# Altium project 100-1069.PRJPCB (part 1 of 2)
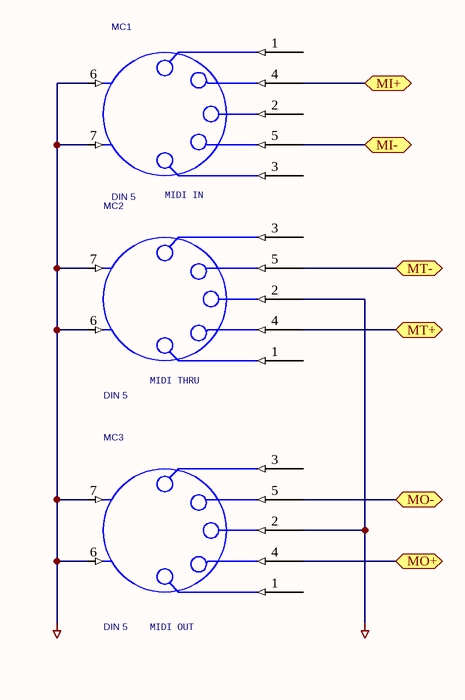
[diagram p0: PAGE1.SchDoc]
24 sheets, 470 parts. Net scope: hierarchical (ports join the sheet entries above them; power ports are global).
Sheets:
  PAGE1.SchDoc
  PAGE11.SchDoc
  PAGE12.SchDoc
  PAGE14.SchDoc
  PAGE15.SchDoc
  PAGE16.SchDoc
  PAGE18.SchDoc
  PAGE19.SchDoc
  PAGE111.SchDoc
  PAGE112.SchDoc
  PAGE113.SchDoc
    POTSCALE1 = PAGE17.SchDoc
    EG1 = PAGE13.SchDoc
    MIDI = PAGE115.SchDoc
    VCO1 = PAGE117.SchDoc
    REF = PAGE110.SchDoc
    VCO2 = PAGE117.SchDoc
    POTSCALE2 = PAGE17.SchDoc
  LFO.SchDoc
  PAGE114.SchDoc
  GLIDE.SchDoc
  PAGE116.SchDoc
  PAGE118.SchDoc
  PAGE119.SchDoc
  PAGE120.SchDoc
  PAGE121.SchDoc

## Sheet PAGE1.SchDoc
size 246 x 182 mm

### Parts
MC1  DIN 5  [DIN 5 PIN A]
MC2  DIN 5  [DIN 5 PIN A]
MC3  DIN 5  [DIN 5 PIN A]

### Ports
MI+, MI-, MO+, MO-, MT+, MT-

### Nets
AGND: MC1.6 MC1.7 MC2.2 MC2.6 MC2.7 MC3.2 MC3.6 MC3.7  [project net S2]
NetMC1_4: MC1.4 ; port MI+
NetMC1_5: MC1.5 ; port MI-
NetMC2_4: MC2.4 ; port MT+
NetMC2_5: MC2.5 ; port MT-
NetMC3_4: MC3.4 ; port MO+
NetMC3_5: MC3.5 ; port MO-

Not connected (* = marked no-connect by the designer): MC1 1 2 3; MC2 1 3; MC3 1 3

### Notes on the sheet
- (near MC1) MIDI IN
- (near MC2) MIDI THRU
- (near MC3) MIDI OUT

### Library data of the parts
MC1-MC3 = DIN 5_0: PART NO: 161-0505

## Sheet PAGE11.SchDoc
size 246 x 182 mm
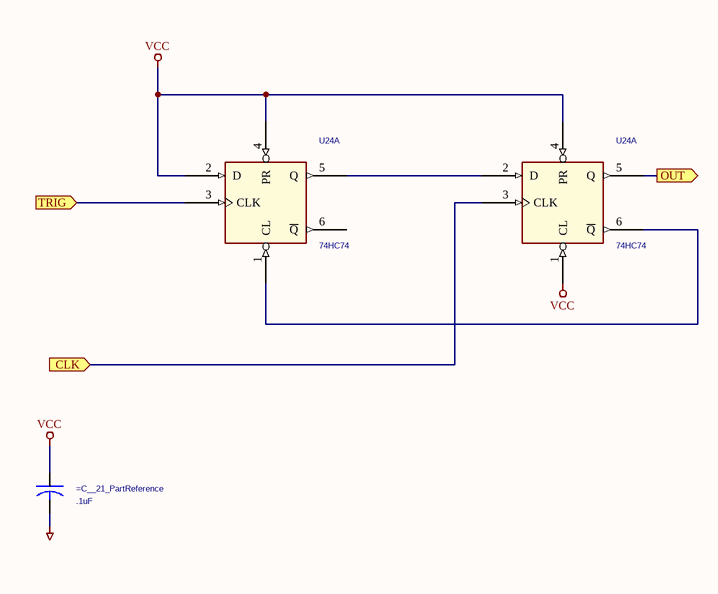
[diagram p1: PAGE11.SchDoc]

### Parts
(Parts that share a designator on the sheet are numbered #1, #2 ... from top to bottom, then left to right.)
=C__21_PartReference  .1uF  [AXIALCAP0.3]
U24#1  74HC74  [DIP14]  (part A of 2)
U24#2  74HC74  [DIP14]  (part A of 2)

### Ports
CLK (in), OUT (out), TRIG (in)

### Nets
AGND: =C__21_PartReference.2 U24#1.7(GND) U24#2.7(GND)  [also labelled GND]  [project net S2]
VCC: =C__21_PartReference.1 U24#1.2(D) U24#1.4(PR) U24#1.14(VCC) U24#2.1(CL) U24#2.4(PR) U24#2.14(VCC)
NetU24#1_1: U24#1.1(CL) U24#2.6(~{Q})
NetU24#1_3: U24#1.3(CLK) ; port TRIG
NetU24#1_5: U24#1.5(Q) U24#2.2(D)
NetU24#2_3: U24#2.3(CLK) ; port CLK
NetU24#2_5: U24#2.5(Q) ; port OUT

Not connected (* = marked no-connect by the designer): U24#1 6(~{Q})

### Library data of the parts
=C__21_PartReference = CAP_Dup1: PART NO: 80-C410C104M5U

## Sheet PAGE12.SchDoc
size 246 x 182 mm
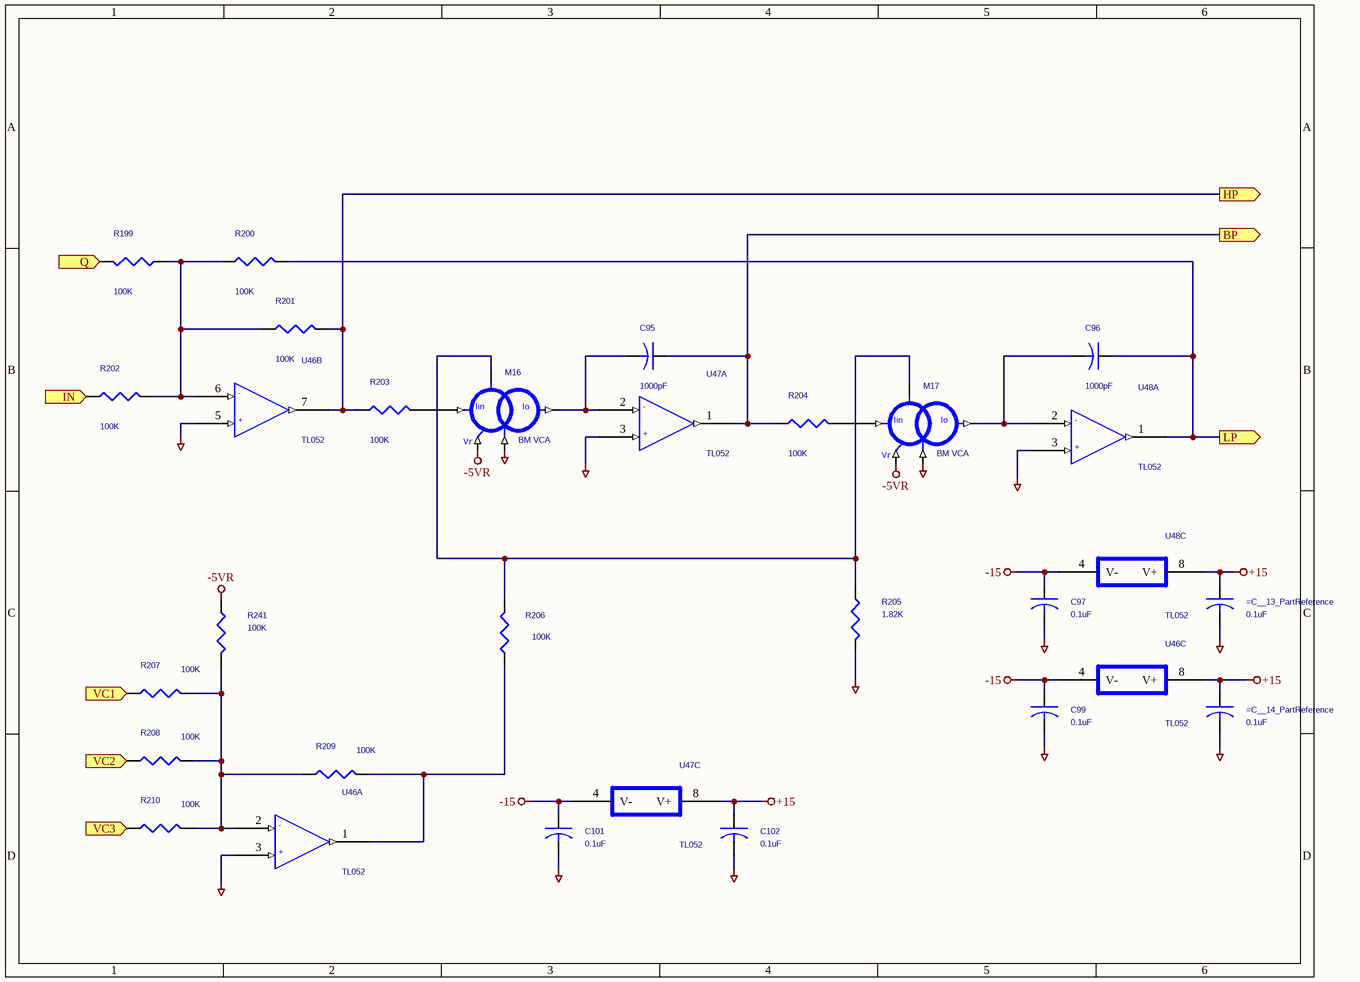
[diagram p2: PAGE12.SchDoc]

### Parts
=C__13_PartReference  0.1uF  [AXIALCAP0.3]
=C__14_PartReference  0.1uF  [AXIALCAP0.3]
C95  1000pF  [AXIAL0.5X0.2]
C96  1000pF  [AXIAL0.5X0.2]
C97  0.1uF  [AXIALCAP0.3]
C99  0.1uF  [AXIALCAP0.3]
C101  0.1uF  [AXIALCAP0.3]
C102  0.1uF  [AXIALCAP0.3]
M16  BM VCA
M17  BM VCA
R199  100K  [AXIAL0.4]
R200  100K  [AXIAL0.4]
R201  100K  [AXIAL0.4]
R202  100K  [AXIAL0.4]
R203  100K  [AXIAL0.4]
R204  100K  [AXIAL0.4]
R205  1.82K  [AXIAL0.4]
R206  100K  [AXIAL0.4]
R207  100K  [AXIAL0.4]
R208  100K  [AXIAL0.4]
R209  100K  [AXIAL0.4]
R210  100K  [AXIAL0.4]
R241  100K  [AXIAL0.4]
U46  TL052  [DIP8]  (parts A,B,C of 3)
U47  TL052  [DIP8]  (parts A,C of 3)
U48  TL052  [DIP8]  (parts A,C of 3)

### Ports
BP (out), HP (out), IN (in), LP (out), Q (in), VC1 (in), VC2 (in), VC3 (in)

### Nets
+15: =C__13_PartReference.1 =C__14_PartReference.1 C102.1 U46.8(V+) U47.8(V+) U48.8(V+)
-5VR: M16.-VR M17.-VR R241.1
-15: C97.1 C99.1 C101.1 U46.4(V-) U47.4(V-) U48.4(V-)
AGND: =C__13_PartReference.2 =C__14_PartReference.2 C97.2 C99.2 C101.2 C102.2 M16.CVP M17.CVP R205.2 U46.3(+) U46.5(+) U47.3(+) U48.3(+)  [project net S2]
NetC95_1: C95.1 R204.1 U47.1(OUT) ; port BP
NetC95_2: C95.2 M16.Io U47.2(-)
NetC96_1: C96.1 R200.2 U48.1(OUT) ; port LP
NetC96_2: C96.2 M17.Io U48.2(-)
NetM16_CVN: M16.CVN M17.CVN R205.1 R206.2
NetM16_Iin: M16.Iin R203.2
NetM17_Iin: M17.Iin R204.2
NetR199_1: R199.1 R200.1 R201.1 R202.2 U46.6(-)
NetR199_2: R199.2 ; port Q
NetR201_2: R201.2 R203.1 U46.7(OUT) ; port HP
NetR202_1: R202.1 ; port IN
NetR206_1: R206.1 R209.2 U46.1(OUT)
NetR207_1: R207.1 ; port VC1
NetR207_2: R207.2 R208.2 R209.1 R210.2 R241.2 U46.2(-)
NetR208_1: R208.1 ; port VC2
NetR210_1: R210.1 ; port VC3

### Notes on the sheet
- (in symbol BM VCA) Vr

### Library data of the parts
=C__13_PartReference =C__14_PartReference C95-C97 C99 C101 C102 = CAP_Dup1
R199-R210 R241 = R_Dup1
U46-U48 = GEN DUAL OPAMP-H
  U46: PACKAGE: VCF
  U47: PACKAGE: VCF1
  U48: PACKAGE: VCF2
M16 M17 = BM VCA
  M16: U__9_PartReference: =M16_U__9_PartReference; U__9_PACKAGE: =M16_U__9_PACKAGE; Q__7_PartReference: =M16_Q__7_PartReference; Q__4_PartReference: =M16_Q__4_PartReference; Q__5_PartReference: =M16_Q__5_PartReference; Q__6_PartReference: =M16_Q__6_PartReference; R__32_PartReference: =M16_R__32_PartReference; R__33_PartReference: =M16_R__33_PartReference; C__10_PartReference: =M16_C__10_PartReference; TitleBlock_2_Page_Number: =M16_TitleBlock_2_Page_Number; TitleBlock_2_Title: =M16_TitleBlock_2_Title
  M17: U__9_PartReference: =M17_U__9_PartReference; U__9_PACKAGE: =M17_U__9_PACKAGE; Q__7_PartReference: =M17_Q__7_PartReference; Q__4_PartReference: =M17_Q__4_PartReference; Q__5_PartReference: =M17_Q__5_PartReference; Q__6_PartReference: =M17_Q__6_PartReference; R__32_PartReference: =M17_R__32_PartReference; R__33_PartReference: =M17_R__33_PartReference; C__10_PartReference: =M17_C__10_PartReference; TitleBlock_2_Page_Number: =M17_TitleBlock_2_Page_Number; TitleBlock_2_Title: =M17_TitleBlock_2_Title

## Sheet PAGE14.SchDoc
size 246 x 182 mm
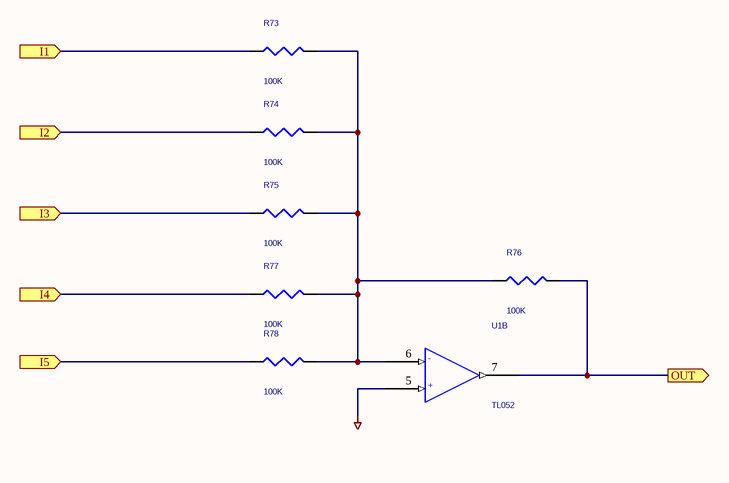
[diagram p3: PAGE14.SchDoc]

### Parts
R73  100K  [AXIAL0.4]
R74  100K  [AXIAL0.4]
R75  100K  [AXIAL0.4]
R76  100K  [AXIAL0.4]
R77  100K  [AXIAL0.4]
R78  100K  [AXIAL0.4]
U1  TL052  [DIP8]  (part B of 3)

### Ports
I1 (in), I2 (in), I3 (in), I4 (in), I5 (in), OUT (out)

### Nets
AGND: U1.5(+)  [project net S2]
NetR73_1: R73.1 ; port I1
NetR73_2: R73.2 R74.2 R75.2 R76.1 R77.2 R78.2 U1.6(-)
NetR74_1: R74.1 ; port I2
NetR75_1: R75.1 ; port I3
NetR76_2: R76.2 U1.7(OUT) ; port OUT
NetR77_1: R77.1 ; port I4
NetR78_1: R78.1 ; port I5

### Library data of the parts
R73-R78 = R_Dup1: MOUSER PN: 271-100K-RC
U1 = GEN DUAL OPAMP-H: PACKAGE: ATNM1MIX

## Sheet PAGE15.SchDoc
size 386 x 284 mm
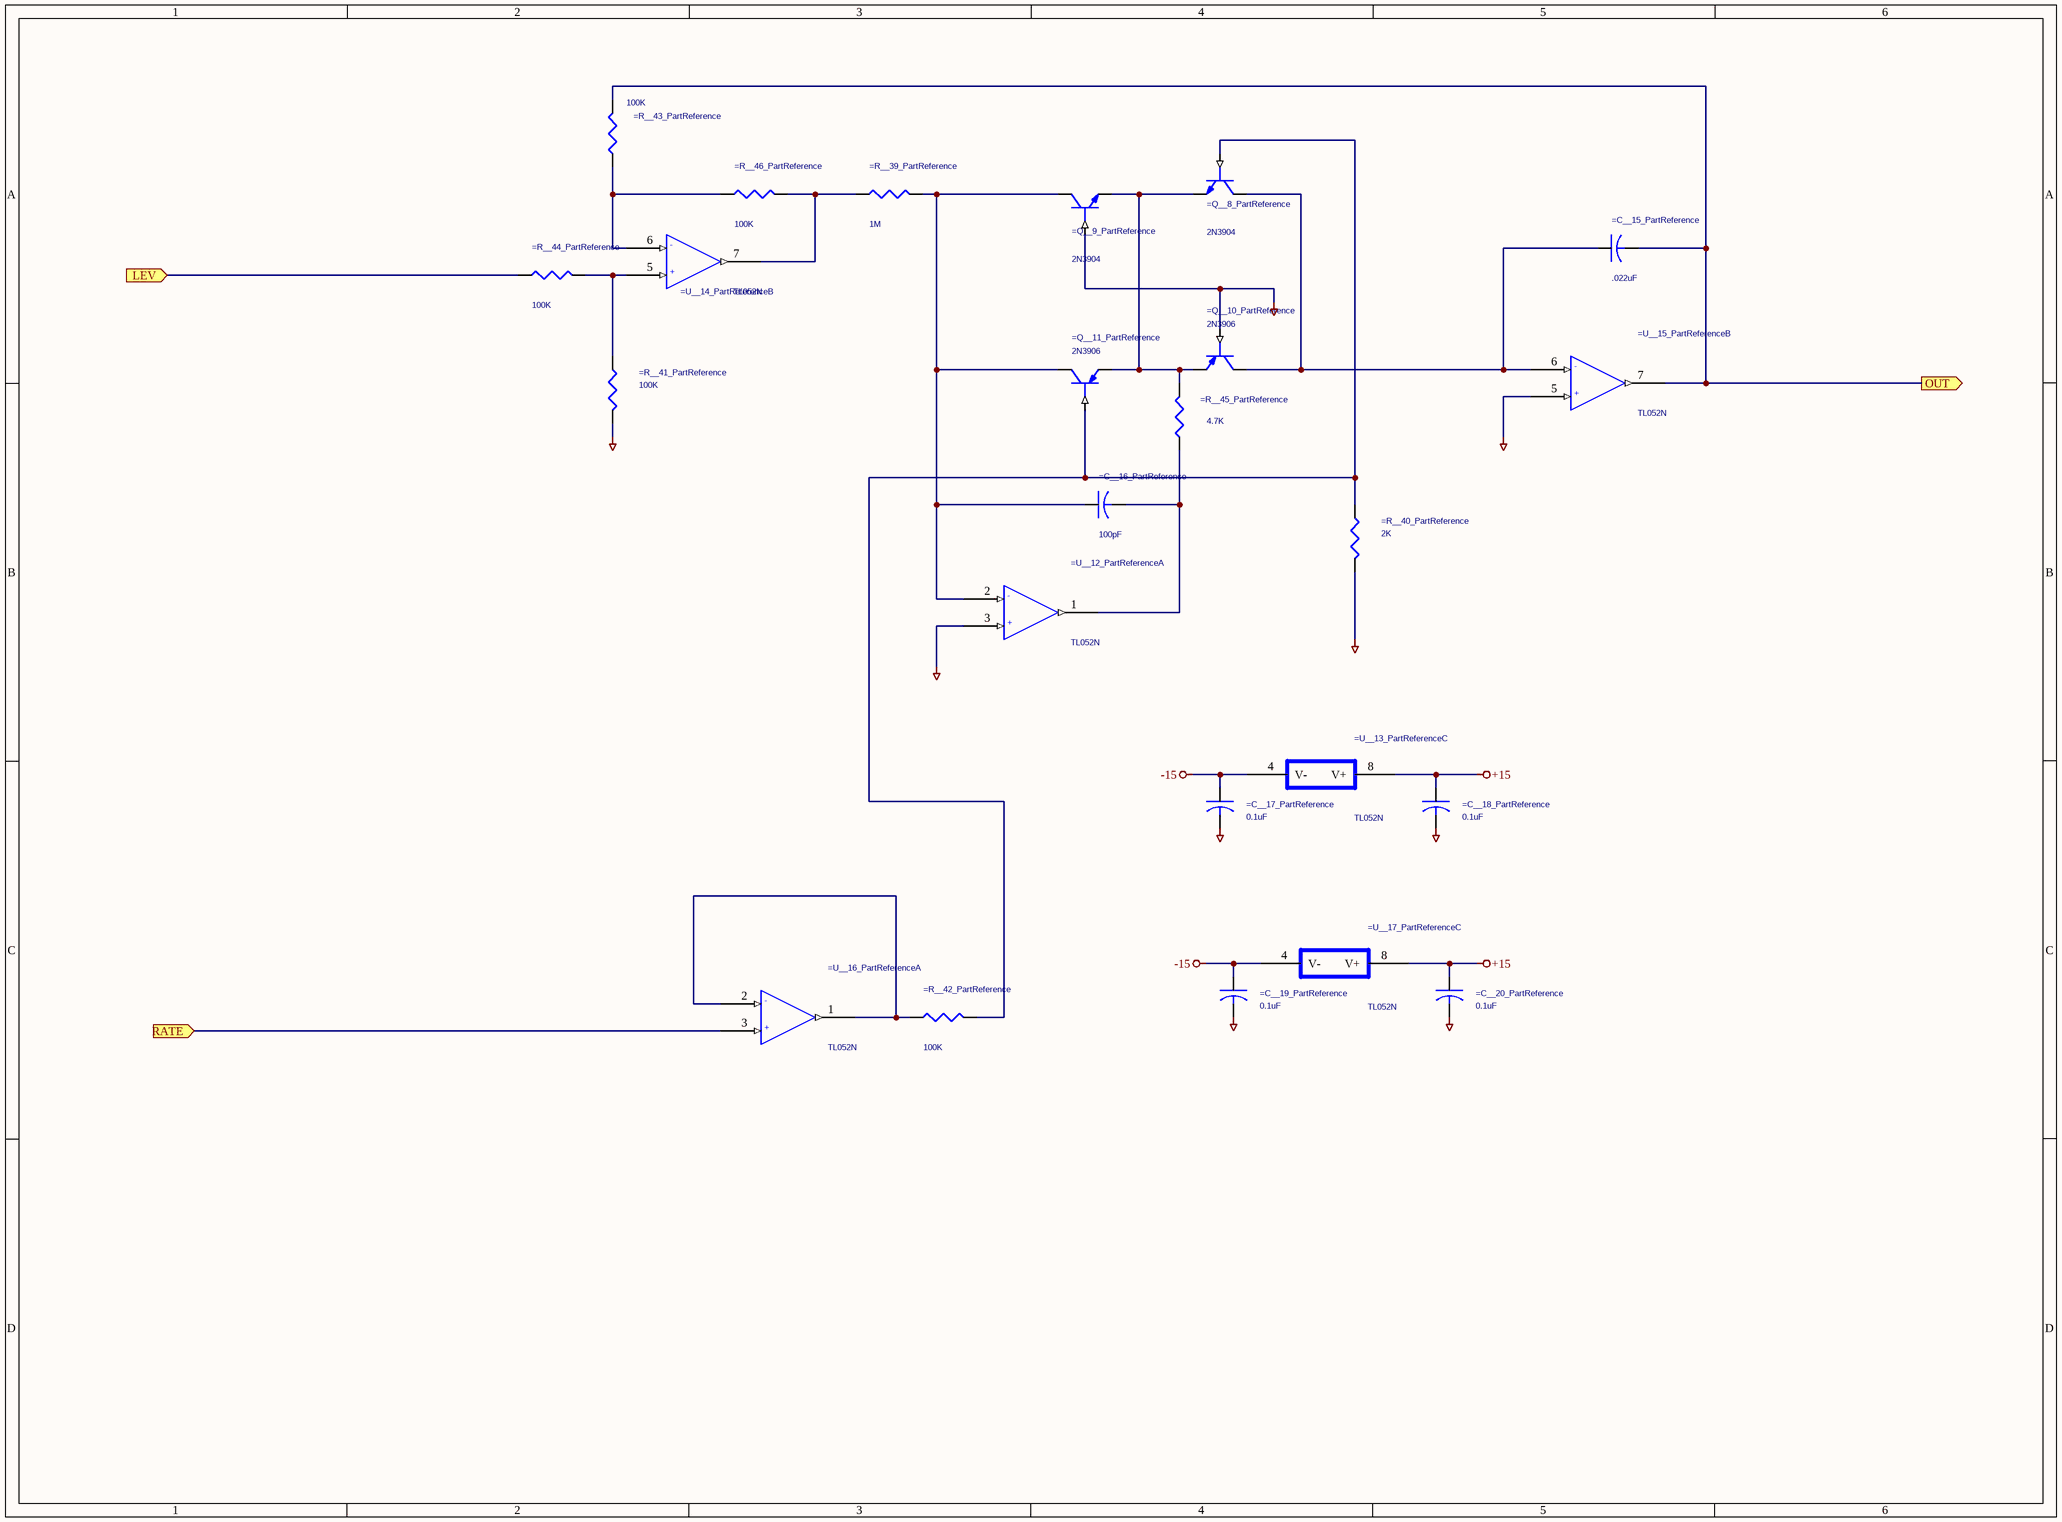
[diagram p4: PAGE15.SchDoc]

### Parts
=C__15_PartReference  .022uF  [CAP-MY0.2X.1]
=C__16_PartReference  100pF  [RAD0.1]
=C__17_PartReference  0.1uF  [AXIALCAP0.3]
=C__18_PartReference  0.1uF  [AXIALCAP0.3]
=C__19_PartReference  0.1uF  [AXIALCAP0.3]
=C__20_PartReference  0.1uF  [AXIALCAP0.3]
=Q__8_PartReference  2N3904  [TO92]
=Q__9_PartReference  2N3904  [TO92]
=Q__10_PartReference  2N3906  [TO92]
=Q__11_PartReference  2N3906  [TO92]
=R__39_PartReference  1M  [AXIAL0.4]
=R__40_PartReference  2K  [AXIAL0.4]
=R__41_PartReference  100K  [AXIAL0.4]
=R__42_PartReference  100K  [AXIAL0.4]
=R__43_PartReference  100K  [AXIAL0.4]
=R__44_PartReference  100K  [AXIAL0.4]
=R__45_PartReference  4.7K  [AXIAL0.4]
=R__46_PartReference  100K  [AXIAL0.4]
=U__12_PartReference  TL052N  [DIP8]  (part A of 3)
=U__13_PartReference  TL052N  [DIP8]  (part C of 3)
=U__14_PartReference  TL052N  [DIP8]  (part B of 3)
=U__15_PartReference  TL052N  [DIP8]  (part B of 3)
=U__16_PartReference  TL052N  [DIP8]  (part A of 3)
=U__17_PartReference  TL052N  [DIP8]  (part C of 3)

### Ports
LEV (in), OUT (out), RATE (in)

### Nets
+15: =C__18_PartReference.1 =C__20_PartReference.1 =U__13_PartReference.8(V+) =U__17_PartReference.8(V+)
-15: =C__17_PartReference.1 =C__19_PartReference.1 =U__13_PartReference.4(V-) =U__17_PartReference.4(V-)
AGND: =C__17_PartReference.2 =C__18_PartReference.2 =C__19_PartReference.2 =C__20_PartReference.2 =Q__9_PartReference.BASE =Q__10_PartReference.BASE =R__40_PartReference.2 =R__41_PartReference.2 =U__12_PartReference.3(+) =U__15_PartReference.5(+)  [project net S2]
Net=C__15_PartReference_1: =C__15_PartReference.1 =Q__8_PartReference.COLLECTOR =Q__10_PartReference.COLLECTOR =U__15_PartReference.6(-)
Net=C__15_PartReference_2: =C__15_PartReference.2 =R__43_PartReference.2 =U__15_PartReference.7(OUT) ; port OUT
Net=C__16_PartReference_1: =C__16_PartReference.1 =Q__9_PartReference.COLLECTOR =Q__11_PartReference.COLLECTOR =R__39_PartReference.2 =U__12_PartReference.2(-)
Net=C__16_PartReference_2: =C__16_PartReference.2 =R__45_PartReference.1 =U__12_PartReference.1(OUT)
Net=Q__8_PartReference_BASE: =Q__8_PartReference.BASE =Q__11_PartReference.BASE =R__40_PartReference.1 =R__42_PartReference.2
Net=Q__8_PartReference_EMITTER: =Q__8_PartReference.EMITTER =Q__9_PartReference.EMITTER =Q__10_PartReference.EMITTER =Q__11_PartReference.EMITTER =R__45_PartReference.2
Net=R__39_PartReference_1: =R__39_PartReference.1 =R__46_PartReference.2 =U__14_PartReference.7(OUT)
Net=R__41_PartReference_1: =R__41_PartReference.1 =R__44_PartReference.2 =U__14_PartReference.5(+)
Net=R__42_PartReference_1: =R__42_PartReference.1 =U__16_PartReference.1(OUT) =U__16_PartReference.2(-)
Net=R__43_PartReference_1: =R__43_PartReference.1 =R__46_PartReference.1 =U__14_PartReference.6(-)
Net=R__44_PartReference_1: =R__44_PartReference.1 ; port LEV
Net=U__16_PartReference_3: =U__16_PartReference.3(+) ; port RATE

### Library data of the parts
=C__15_PartReference =C__16_PartReference =C__17_PartReference =C__18_PartReference =C__19_PartReference =C__20_PartReference = CAP_Dup1
  =C__15_PartReference: DIGIKEY PN: P4717-ND
  =C__16_PartReference: MOUSER PN: 140-50P2-101K-RC
=Q__8_PartReference =Q__9_PartReference = NPN: DIGIKEY PN: 2N3904FS-ND
=Q__10_PartReference =Q__11_PartReference = PNP: DIGIKEY PN: 2N3906FS-ND
=R__39_PartReference =R__40_PartReference =R__41_PartReference =R__42_PartReference =R__43_PartReference =R__44_PartReference =R__45_PartReference =R__46_PartReference = R_Dup1
  =R__39_PartReference: MOUSER PN: 271-1M-RC
  =R__40_PartReference: MOUSER PN: 271-2K-RC
  =R__41_PartReference =R__42_PartReference =R__43_PartReference =R__44_PartReference =R__46_PartReference: MOUSER PN: 271-100K-RC
  =R__45_PartReference: MOUSER PN: 271-4.7K-RC
=U__12_PartReference =U__13_PartReference =U__14_PartReference =U__15_PartReference =U__16_PartReference =U__17_PartReference = TL052N: DIGIKEY PN: 296-7163-5-ND
  =U__12_PartReference: PACKAGE: =U__12_PACKAGE
  =U__13_PartReference: PACKAGE: =U__13_PACKAGE
  =U__14_PartReference: PACKAGE: =U__14_PACKAGE
  =U__15_PartReference: PACKAGE: =U__15_PACKAGE
  =U__16_PartReference: PACKAGE: =U__16_PACKAGE
  =U__17_PartReference: PACKAGE: =U__17_PACKAGE

## Sheet PAGE16.SchDoc
size 246 x 182 mm
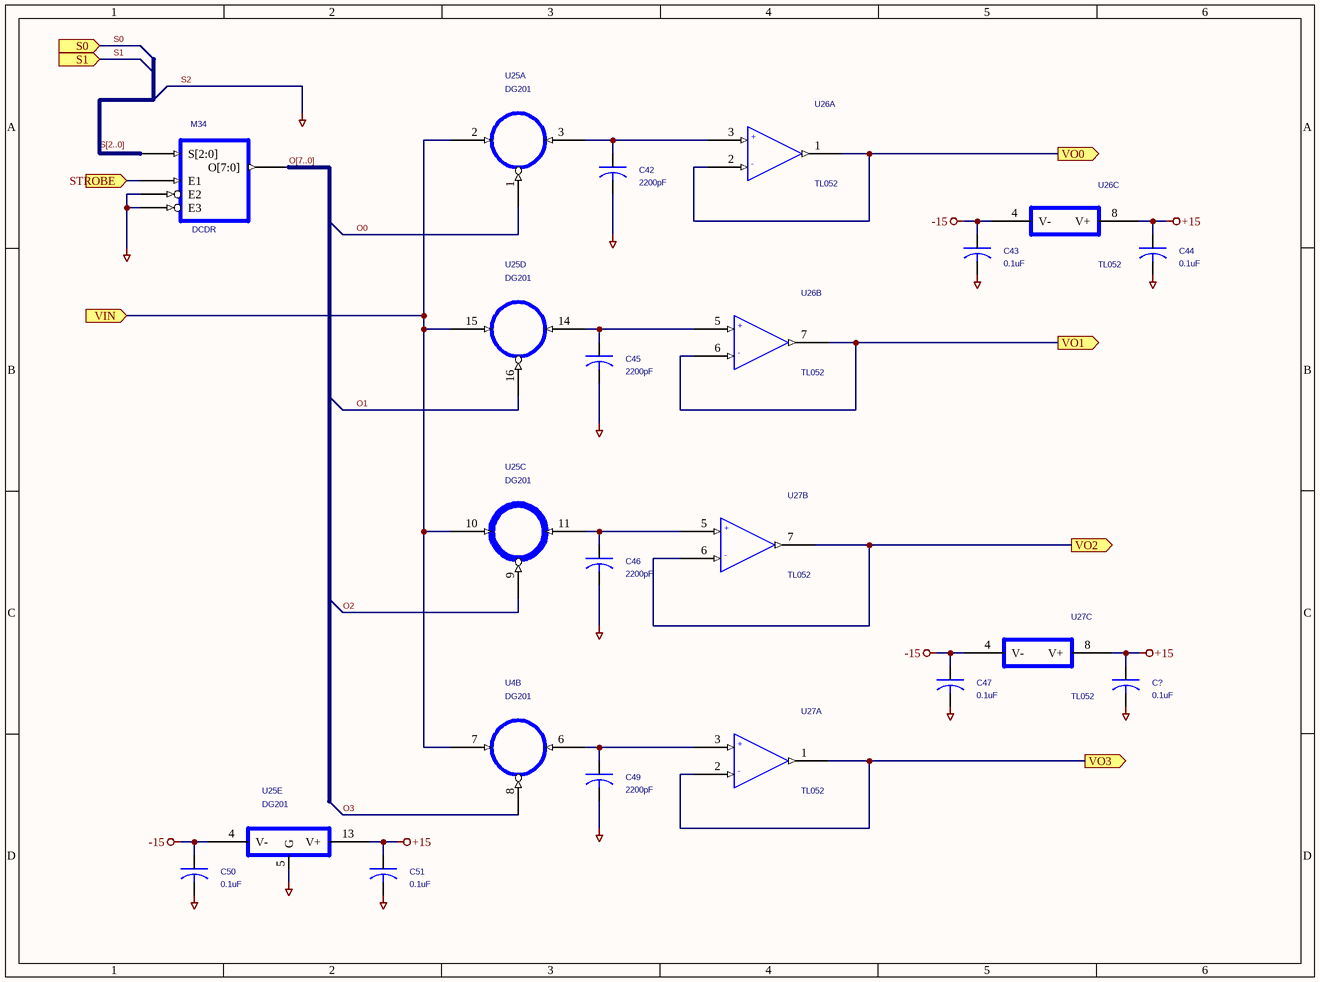
[diagram p5: PAGE16.SchDoc]

### Parts
(Parts that share a designator on the sheet are numbered #1, #2 ... from top to bottom, then left to right.)
C42  2200pF  [AXIAL0.5X0.2]
C43  0.1uF  [AXIALCAP0.3]
C44  0.1uF  [AXIALCAP0.3]
C45  2200pF  [AXIAL0.5X0.2]
C46  2200pF  [AXIAL0.5X0.2]
C47  0.1uF  [AXIALCAP0.3]
C49  2200pF  [AXIAL0.5X0.2]
C50  0.1uF  [AXIALCAP0.3]
C51  0.1uF  [AXIALCAP0.3]
C?#1  0.1uF  [AXIALCAP0.3]
M34  DCDR
U4#1  DG201  [DIP16]  (part B of 5)
U25  DG201  [DIP16]  (parts A,C,D,E of 5)
U26  TL052  [DIP8]  (parts A,B,C of 3)
U27  TL052  [DIP8]  (parts A,B,C of 3)

### Ports
S0 (in), S1 (in), STROBE (in), VIN (in), VO0 (out), VO1 (out), VO2 (out), VO3 (out)

### Nets
+15: C44.1 C51.1 C?#1.1 U25.13(V+) U26.8(V+) U27.8(V+)
-15: C43.1 C47.1 C50.1 U25.4(V-) U26.4(V-) U27.4(V-)
S2: C42.2 C43.2 C44.2 C45.2 C46.2 C47.2 C49.2 C50.2 C51.2 C?#1.2 M34.E2 M34.E3 U25.5(G)  [also labelled AGND]
O0: U25.1(IN)
O1: U25.16(IN)
O2: U25.9(IN)
O3: U4#1.8(IN)
S0: port S0
S1: port S1
NetC42_1: C42.1 U25.3(S1) U26.3(+)
NetC45_1: C45.1 U25.14(S1) U26.5(+)
NetC46_1: C46.1 U25.11(S1) U27.5(+)
NetC49_1: C49.1 U4#1.6(S1) U27.3(+)
NetM34_E1: M34.E1 ; port STROBE
NetU4#1_7: U4#1.7(D) U25.2(D) U25.10(D) U25.15(D) ; port VIN
NetU26_1: U26.1(OUT) U26.2(-) ; port VO0
NetU26_6: U26.6(-) U26.7(OUT) ; port VO1
NetU27_1: U27.1(OUT) U27.2(-) ; port VO3
NetU27_6: U27.6(-) U27.7(OUT) ; port VO2

Not connected (* = marked no-connect by the designer): M34 O[7:0] S[2:0]

### Buses and harness runs
bus O[7..0]
bus S[2..0]

### Library data of the parts
C42 C45 C46 C49 = CAP
C43 C44 C47 C50 C51 C?#1 = CAP_Dup1
U4#1 U25 = DG201H: PACKAGE: SH1; DIGIKEY PN: ADG201AKNZ-ND
U26 U27 = GEN DUAL OPAMP-H
  U26: PACKAGE: SH2
  U27: PACKAGE: BUFF2
M34 = DCDR: C__21_PartReference: =M34_C__21_PartReference; TitleBlock_1_Page_Number: =M34_TitleBlock_1_Page_Number; TitleBlock_1_Title: =M34_TitleBlock_1_Title

## Sheet PAGE18.SchDoc
size 246 x 182 mm
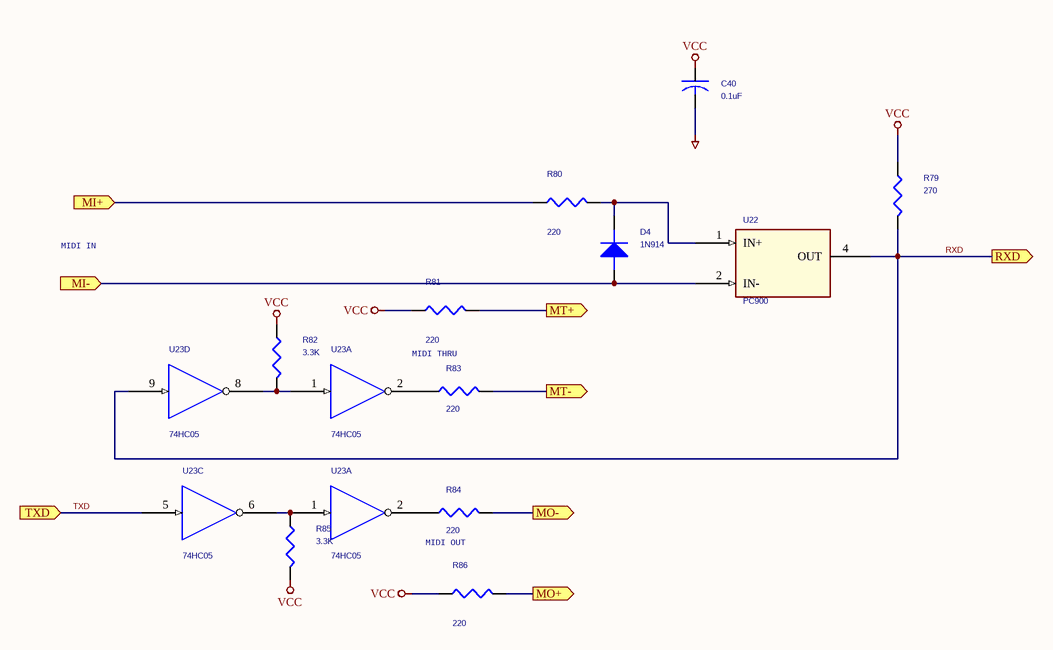
[diagram p6: PAGE18.SchDoc]

### Parts
(Parts that share a designator on the sheet are numbered #1, #2 ... from top to bottom, then left to right.)
C40  0.1uF  [AXIALCAP0.3]
D4  1N914  [DIODE0.4]
R79  270  [AXIAL0.4]
R80  220  [AXIAL0.4]
R81  220  [AXIAL0.4]
R82  3.3K  [AXIAL0.4]
R83  220  [AXIAL0.4]
R84  220  [AXIAL0.4]
R85  3.3K  [AXIAL0.4]
R86  220  [AXIAL0.4]
U22  PC900  [DIP6]
U23#1  74HC05  [DIP14]  (parts A,C,D of 6)
U23#2  74HC05  [DIP14]  (part A of 6)

### Ports
MI+ (in), MI- (in), MO+ (out), MO- (out), MT+ (out), MT- (out), RXD (out), TXD (in)

### Nets
DGND: C40.2
GND: U22.5(GND) U23#1.7(GND) U23#2.7(GND)  [project net S2]
VCC: C40.1 R79.1 R81.2 R82.1 R85.2 R86.2 U22.6(VCC) U23#1.14(VCC) U23#2.14(VCC)
RXD: R79.2 U22.4(OUT) U23#1.9(I) ; port RXD
TXD: U23#1.5(I) ; port TXD
NetD4_ANODE: D4.ANODE U22.2(IN-) ; port MI-
NetD4_CATHODE: D4.CATHODE R80.2 U22.1(IN+)
NetR80_1: R80.1 ; port MI+
NetR81_1: R81.1 ; port MT+
NetR82_2: R82.2 U23#1.1(I) U23#1.8(O)
NetR83_1: R83.1 U23#1.2(O)
NetR83_2: R83.2 ; port MT-
NetR84_1: R84.1 U23#2.2(O)
NetR84_2: R84.2 ; port MO-
NetR85_1: R85.1 U23#1.6(O) U23#2.1(I)
NetR86_1: R86.1 ; port MO+

### Notes on the sheet
- MIDI IN
- MIDI THRU
- MIDI OUT

### Library data of the parts
C40 = CAP_Dup1
D4 = DIODE_Dup1
R79-R81 R83 R84 R86 = R
R82 R85 = R_Dup1

## Sheet PAGE19.SchDoc
size 246 x 182 mm
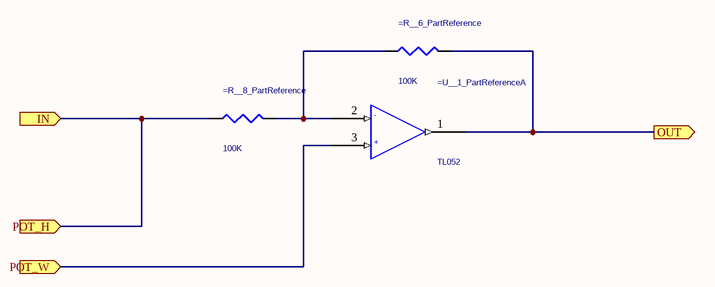
[diagram p7: PAGE19.SchDoc]

### Parts
=R__6_PartReference  100K  [AXIAL0.4]
=R__8_PartReference  100K  [AXIAL0.4]
=U__1_PartReference  TL052  [DIP8]  (part A of 3)

### Ports
IN (in), OUT (out), POT_H (in), POT_W (in)

### Nets
Net=R__6_PartReference_1: =R__6_PartReference.1 =R__8_PartReference.2 =U__1_PartReference.2(-)
Net=R__6_PartReference_2: =R__6_PartReference.2 =U__1_PartReference.1(OUT) ; port OUT
Net=R__8_PartReference_1: =R__8_PartReference.1 ; port IN, port POT_H
Net=U__1_PartReference_3: =U__1_PartReference.3(+) ; port POT_W

### Library data of the parts
=R__6_PartReference =R__8_PartReference = R_Dup1
=U__1_PartReference = GEN DUAL OPAMP-H: PACKAGE: =U__1_PACKAGE

## Sheet PAGE111.SchDoc
size 246 x 182 mm
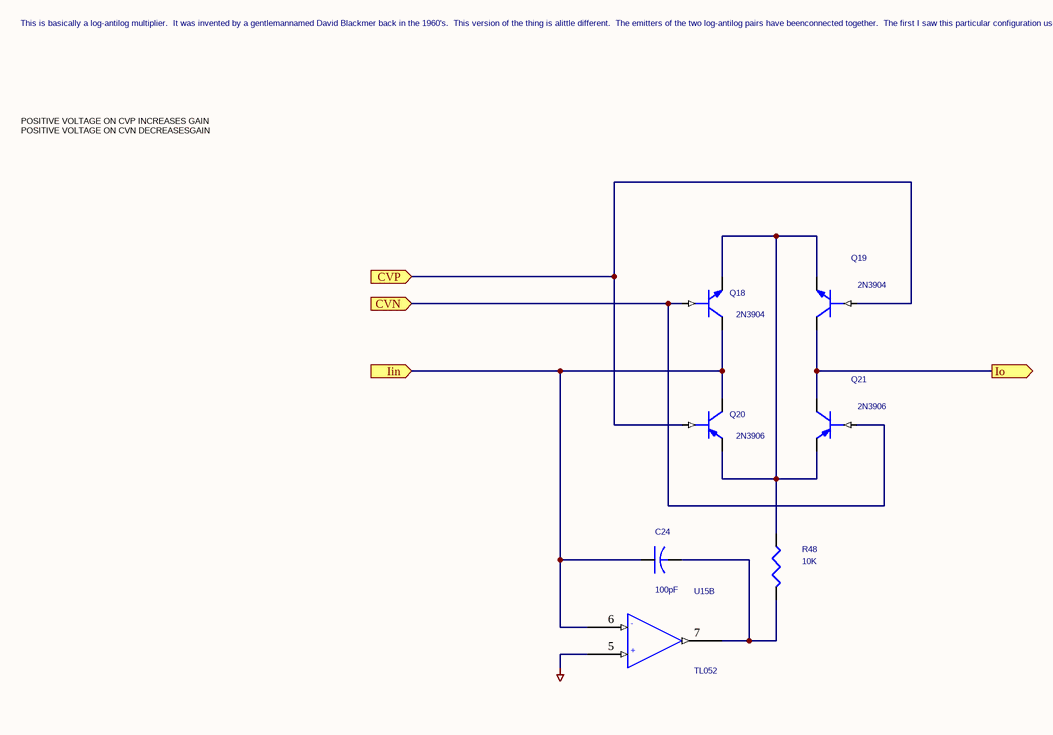
[diagram p8: PAGE111.SchDoc]

### Parts
C24  100pF  [RAD0.1]
Q18  2N3904  [TO92]
Q19  2N3904  [TO92]
Q20  2N3906  [TO92]
Q21  2N3906  [TO92]
R48  10K  [AXIAL0.4]
U15  TL052  [DIP8]  (part B of 3)

### Ports
CVN (in), CVP (in), Iin (in), Io (out)

### Nets
AGND: U15.5(+)  [project net S2]
NetC24_1: C24.1 Q18.COLLECTOR Q20.COLLECTOR U15.6(-) ; port Iin
NetC24_2: C24.2 R48.2 U15.7(OUT)
NetQ18_BASE: Q18.BASE Q21.BASE ; port CVN
NetQ18_EMITTER: Q18.EMITTER Q19.EMITTER Q20.EMITTER Q21.EMITTER R48.1
NetQ19_BASE: Q19.BASE Q20.BASE ; port CVP
NetQ19_COLLECTOR: Q19.COLLECTOR Q21.COLLECTOR ; port Io

### Notes on the sheet
- This is basically a log-antilog multiplier.  It was invented by a gentlemannamed David Blackmer back in the 1960's.  This version of the thing is alittle different.  The emitters of the two log-antilog pairs have beenconnected together.  The first I saw this particular configuration used wasby Jürgen Haible.  It is a very cleaver and useful version of the BlackmerLog-Antilog Multiplier.
- POSITIVE VOLTAGE ON CVP INCREASES GAIN
  POSITIVE VOLTAGE ON CVN DECREASESGAIN

### Library data of the parts
C24 = CAP_Dup1
Q18 Q19 = NPN
Q20 Q21 = PNP
R48 = R_Dup1
U15 = GEN DUAL OPAMP-H: PACKAGE: GLIDE2

## Sheet PAGE112.SchDoc
size 246 x 182 mm
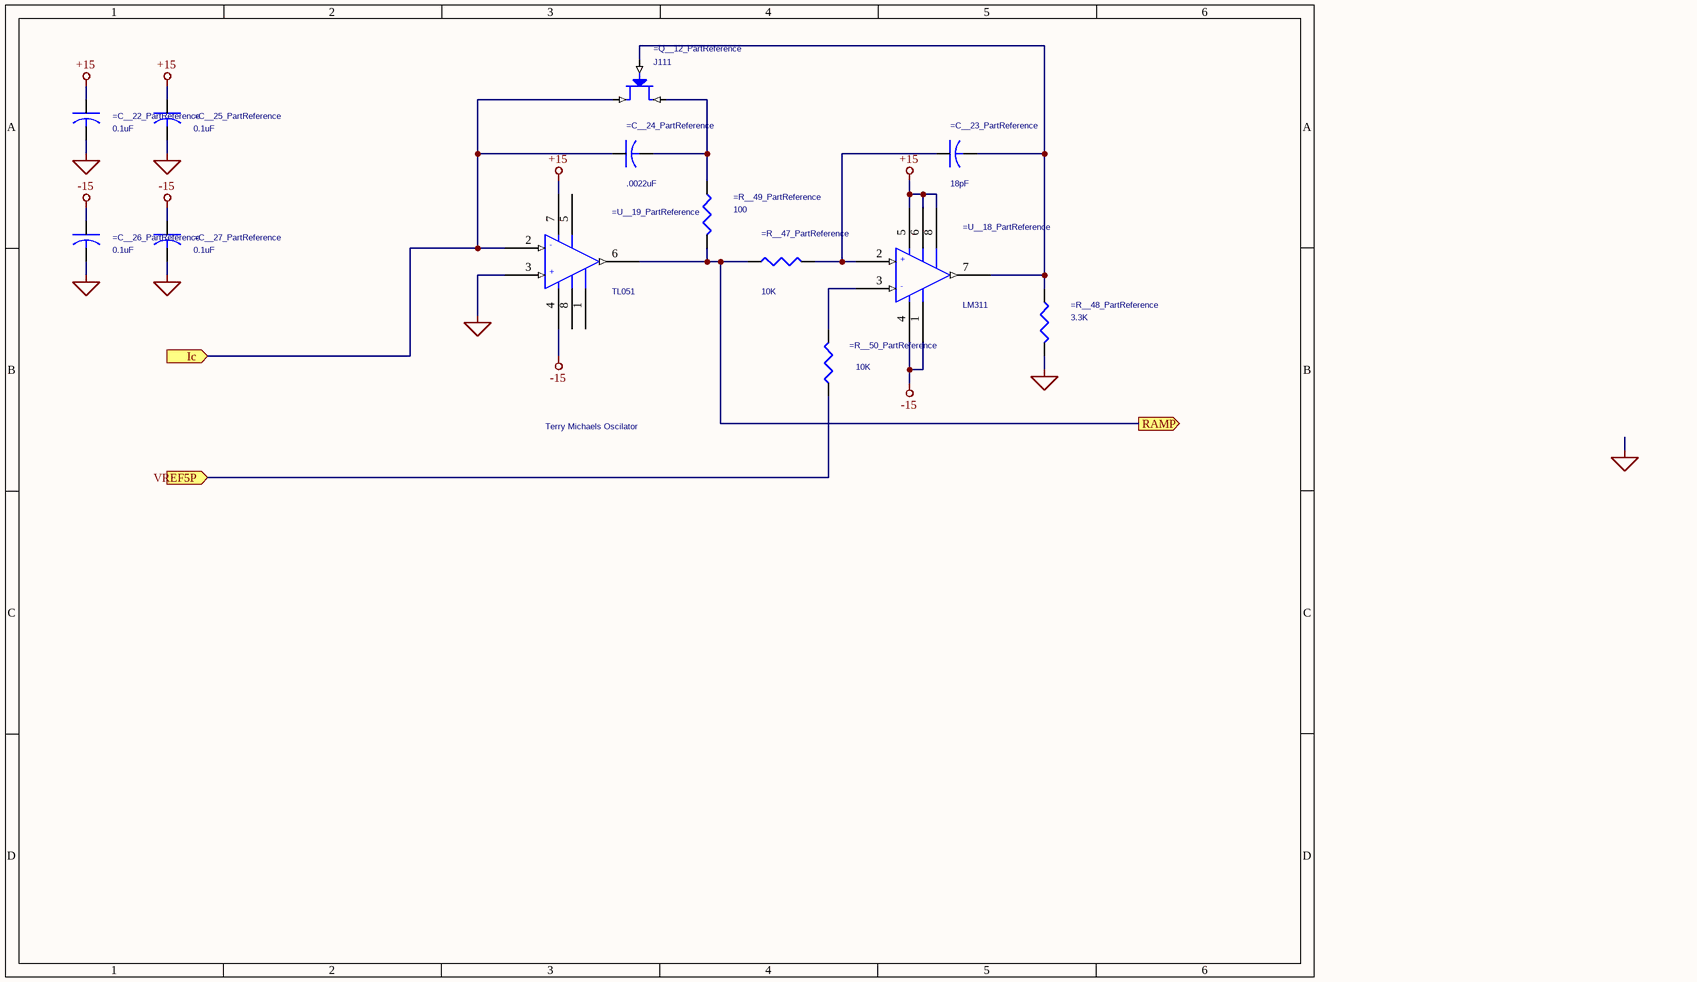
[diagram p9: PAGE112.SchDoc]

### Parts
=C__22_PartReference  0.1uF  [AXIALCAP0.3]
=C__23_PartReference  18pF  [RAD0.1]
=C__24_PartReference  .0022uF  [AXIAL0.5X0.2]
=C__25_PartReference  0.1uF  [AXIALCAP0.3]
=C__26_PartReference  0.1uF  [AXIALCAP0.3]
=C__27_PartReference  0.1uF  [AXIALCAP0.3]
=Q__12_PartReference  J111  [TO92-J111]
=R__47_PartReference  10K  [AXIAL0.4]
=R__48_PartReference  3.3K  [AXIAL0.4]
=R__49_PartReference  100  [AXIAL0.4]
=R__50_PartReference  10K  [AXIAL0.4]
=U__18_PartReference  LM311  [DIP8]
=U__19_PartReference  TL051  [DIP8]

### Ports
Ic (in), RAMP (out), VREF5P (in)

### Nets
+15: =C__22_PartReference.1 =C__25_PartReference.1 =U__18_PartReference.5(BALANCE) =U__18_PartReference.6(BAL/STROBE) =U__18_PartReference.8(V+) =U__19_PartReference.7(V+)
-15: =C__26_PartReference.1 =C__27_PartReference.1 =U__18_PartReference.1(GND) =U__18_PartReference.4(V-) =U__19_PartReference.4(V-)
GND: =C__22_PartReference.2 =C__25_PartReference.2 =C__26_PartReference.2 =C__27_PartReference.2 =R__48_PartReference.2 =U__19_PartReference.3(+IN)  [project net S2]
Net=C__23_PartReference_1: =C__23_PartReference.1 =R__47_PartReference.2 =U__18_PartReference.2(+IN)
Net=C__23_PartReference_2: =C__23_PartReference.2 =Q__12_PartReference.GATE =R__48_PartReference.1 =U__18_PartReference.7(OUT)
Net=C__24_PartReference_1: =C__24_PartReference.1 =Q__12_PartReference.SOURCE =U__19_PartReference.2(-IN) ; port Ic
Net=C__24_PartReference_2: =C__24_PartReference.2 =Q__12_PartReference.DRAIN =R__49_PartReference.1
Net=R__47_PartReference_1: =R__47_PartReference.1 =R__49_PartReference.2 =U__19_PartReference.6(OUT) ; port RAMP
Net=R__50_PartReference_1: =R__50_PartReference.1 ; port VREF5P
Net=R__50_PartReference_2: =R__50_PartReference.2 =U__18_PartReference.3(-IN)

Not connected (* = marked no-connect by the designer): =U__19_PartReference 1(COMP3) 5(COMP1) 8(COMP2)

### Notes on the sheet
- Terry Michaels Oscilator
- (in symbol GENERIC OPAMP) -; +
- (in symbol LM311) +; -

### Library data of the parts
=C__22_PartReference =C__25_PartReference =C__26_PartReference =C__27_PartReference = CAP_Dup1: PART NO: 80-C410C104M5U
=C__23_PartReference = CAP_Dup1: PART NO: 140-50N2-180J
=C__24_PartReference = CAP_Dup1: PART NO: 23PS310
=Q__12_PartReference = JFET N: PART NO: J111
=R__47_PartReference =R__50_PartReference = R_Dup1: PART NO: 271-10K; MOUSER PN: 271-10K-RC
=R__48_PartReference = R_Dup1: PART NO: 271-3.3K; MOUSER PN: 271-3.3K-RC
=R__49_PartReference = R_Dup1: PART NO: 271-100; MOUSER PN: 271-100-RC
=U__18_PartReference = LM311: PART NO: 511-LM311; DIGIKEY PN: 296-1389-5-ND
=U__19_PartReference = GENERIC OPAMP: MOUSER PN: 595-TL051ACP

## Sheet PAGE113.SchDoc
size 386 x 284 mm
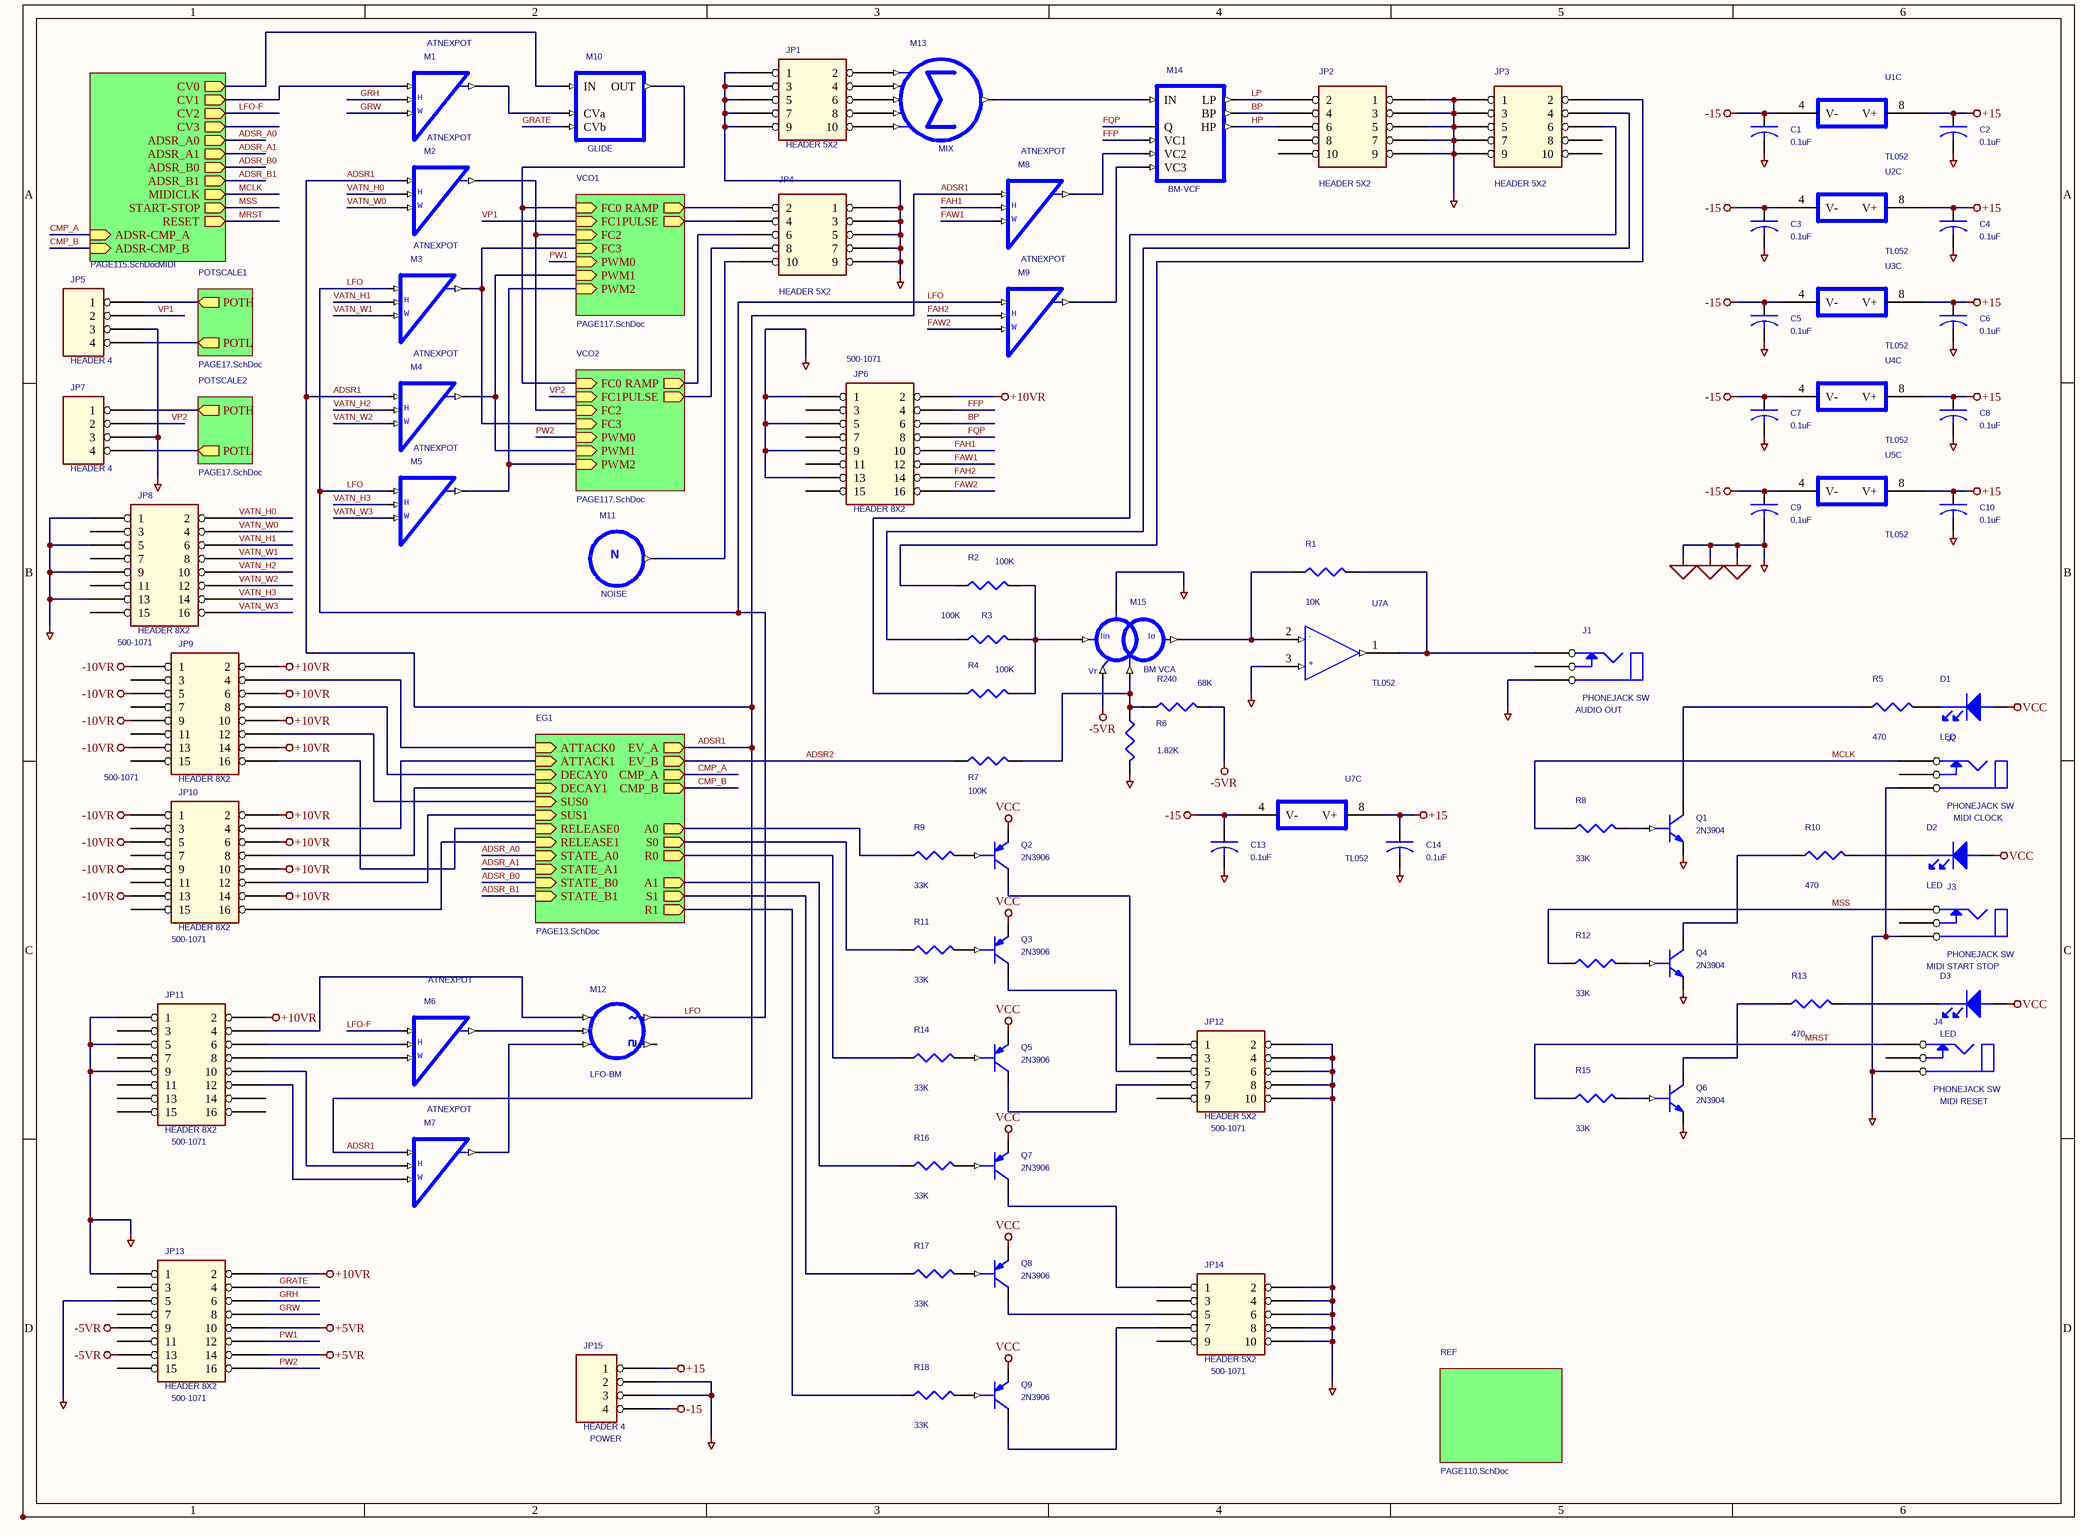
[diagram p10: PAGE113.SchDoc]

### Parts
(Parts that share a designator on the sheet are numbered #1, #2 ... from top to bottom, then left to right.)
C1  0.1uF  [AXIALCAP0.3]
C2  0.1uF  [AXIALCAP0.3]
C3  0.1uF  [AXIALCAP0.3]
C4  0.1uF  [AXIALCAP0.3]
C5  0.1uF  [AXIALCAP0.3]
C6  0.1uF  [AXIALCAP0.3]
C7  0.1uF  [AXIALCAP0.3]
C8  0.1uF  [AXIALCAP0.3]
C9  0.1uF  [AXIALCAP0.3]
C10  0.1uF  [AXIALCAP0.3]
C13  0.1uF  [AXIALCAP0.3]
C14  0.1uF  [AXIALCAP0.3]
D1  LED
D2  LED
D3  LED
J1  PHONEJACK SW  [PHONE-N114A]
J2  PHONEJACK SW  [PHONE-N114A]
J3  PHONEJACK SW  [PHONE-N114A]
J4  PHONEJACK SW  [PHONE-N114A]
JP1  HEADER 5X2  [IDC10-AMP]
JP2  HEADER 5X2  [IDC10-AMP]
JP3  HEADER 5X2  [IDC10-AMP]
JP4  HEADER 5X2  [IDC10-AMP]
JP5  HEADER 4  [MODU-4S-RA]
JP6  HEADER 8X2  [IDC16-AMP]
JP7  HEADER 4  [MODU-4S-RA]
JP8  HEADER 8X2  [IDC16-AMP]
JP9  HEADER 8X2  [IDC16-AMP]
JP10  HEADER 8X2  [IDC16-AMP]
JP11  HEADER 8X2  [IDC16-AMP]
JP12  HEADER 5X2  [IDC10-AMP]
JP13  HEADER 8X2  [IDC16-AMP]
JP14  HEADER 5X2  [IDC10-AMP]
JP15  HEADER 4  [MTA-4X156-RA]
M1#1  ATNEXPOT
M2  ATNEXPOT
M3  ATNEXPOT
M4  ATNEXPOT
M5  ATNEXPOT
M6  ATNEXPOT
M7  ATNEXPOT
M8  ATNEXPOT
M9  ATNEXPOT
M10  GLIDE
M11  NOISE
M12  LFO-BM
M13  MIX
M14  BM-VCF
M15  BM VCA
Q1  2N3904  [TO92]
Q2  2N3906  [TO92]
Q3  2N3906  [TO92]
Q4  2N3904  [TO92]
Q5  2N3906  [TO92]
Q6  2N3904  [TO92]
Q7  2N3906  [TO92]
Q8  2N3906  [TO92]
Q9  2N3906  [TO92]
R1  10K  [AXIAL0.4]
R2  100K  [AXIAL0.4]
R3  100K  [AXIAL0.4]
R4  100K  [AXIAL0.4]
R5  470  [AXIAL0.4]
R6  1.82K  [AXIAL0.4]
R7  100K  [AXIAL0.4]
R8  33K  [AXIAL0.4]
R9  33K  [AXIAL0.4]
R10  470  [AXIAL0.4]
R11  33K  [AXIAL0.4]
R12  33K  [AXIAL0.4]
R13  470  [AXIAL0.4]
R14  33K  [AXIAL0.4]
R15  33K  [AXIAL0.4]
R16  33K  [AXIAL0.4]
R17  33K  [AXIAL0.4]
R18  33K  [AXIAL0.4]
R240  68K  [AXIAL0.4]
U1  TL052  [DIP8]  (part C of 3)
U2  TL052  [DIP8]  (part C of 3)
U3  TL052  [DIP8]  (part C of 3)
U4#2  TL052  [DIP8]  (part C of 3)
U5  TL052  [DIP8]  (part C of 3)
U7  TL052  [DIP8]  (parts A,C of 3)

### Sub-sheets
EG1 = PAGE13.SchDoc: ATTACK0 (in), ATTACK1 (in), DECAY0 (in), DECAY1 (in), SUS0 (in), SUS1 (in), RELEASE0 (in), RELEASE1 (in), STATE_A0 (in), STATE_A1 (in), STATE_B0 (in), STATE_B1 (in), EV_A (out), EV_B (out), CMP_A (out), CMP_B (out), A0 (out), A1 (out), S0 (out), S1 (out), R0 (out), R1 (out)  | M26_PartReference: M26; M26_Q__11_PartReference: Q13; M26_Q__8_PartReference: Q10; M26_C__17_PartReference: C116; M26_U__17_PartReference: U11; M26_U__17_PACKAGE: ADSR_1; M26_Q__9_PartReference: Q11; M26_C__18_PartReference: C117; M26_R__43_PartReference: R28; M26_C__19_PartReference: C118; M26_U__12_PartReference: U12; M26_U__12_PACKAGE: ADSR_2; M26_R__44_PartReference: R31; M26_C__20_PartReference: C119; M26_R__45_PartReference: R33; M26_Q__10_PartReference: Q12; M26_C__15_PartReference: C20; M26_U__13_PartReference: U12; M26_U__13_PACKAGE: ADSR_2; M26_R__39_PartReference: R30; M26_U__14_PartReference: U11; M26_U__14_PACKAGE: ADSR_1; M26_C__16_PartReference: C21; M26_U__15_PartReference: U12; M26_U__15_PACKAGE: ADSR_2; M26_R__40_PartReference: R34; M26_U__16_PartReference: U11; M26_U__16_PACKAGE: ADSR_1; M26_R__41_PartReference: R32; M26_R__46_PartReference: R29; M26_R__42_PartReference: R37; M26_TitleBlock_7_Page_Number: 3; M26_TitleBlock_7_Title: SIMPLE EV GENERATOR M26; M27_PartReference: M27; M27_Q__11_PartReference: Q17; M27_Q__8_PartReference: Q14; M27_C__17_PartReference: C120; M27_U__17_PartReference: U13; M27_U__17_PACKAGE: ADSR_1_1; M27_Q__9_PartReference: Q15; M27_C__18_PartReference: C121; M27_R__43_PartReference: R38; M27_C__19_PartReference: C122; M27_U__12_PartReference: U14; M27_U__12_PACKAGE: ADSR_2_1; M27_R__44_PartReference: R41; M27_C__20_PartReference: C123; M27_R__45_PartReference: R43; M27_Q__10_PartReference: Q16; M27_C__15_PartReference: C22; M27_U__13_PartReference: U14; M27_U__13_PACKAGE: ADSR_2_1; M27_R__39_PartReference: R40; M27_U__14_PartReference: U13; M27_U__14_PACKAGE: ADSR_1_1; M27_C__16_PartReference: C23; M27_U__15_PartReference: U14; M27_U__15_PACKAGE: ADSR_2_1; M27_R__40_PartReference: R44; M27_U__16_PartReference: U13; M27_U__16_PACKAGE: ADSR_1_1; M27_R__41_PartReference: R42; M27_R__46_PartReference: R39; M27_R__42_PartReference: R47; M27_TitleBlock_7_Page_Number: 4; M27_TitleBlock_7_Title: SIMPLE EV GENERATOR M27; TitleBlock_Page_Number: 20; TitleBlock_Title: NOOTA-DUAL ENVELOPE GENERATOR
MIDI = PAGE115.SchDoc: CV0 (out), CV1 (out), CV2 (out), CV3 (out), ADSR_A0 (out), ADSR_A1 (out), ADSR_B0 (out), ADSR_B1 (out), MIDICLK (out), START-STOP (out), RESET (out), ADSR-CMP_A (in), ADSR-CMP_B (in)  | M26_PartReference: M26; M26_TitleBlock_1_Page_Number: 10; M26_TitleBlock_1_Title: MIDI CONNECTORS; U__4_PartReference: U9; M27_PartReference: M27; M27_C__21_PartReference: C41; M27_TitleBlock_1_Page_Number: 12; M27_TitleBlock_1_Title: MIDI CONNECTORS; U__5_PartReference: U9; U__6_PartReference: U9; M28_TitleBlock_1_Page_Number: 14; M28_TitleBlock_1_Title: MIDI CONNECTORS; M29_TitleBlock_4_Page_Number: 11; M31_C__13_PartReference: C48; M31_M34_C__21_PartReference: C66; M31_M34_TitleBlock_1_Page_Number: 28; M31_M34_TitleBlock_1_Title: MIDI CONNECTORS; M31_C__14_PartReference: U25; TitleBlock_Page_Number: 2; TitleBlock_Title: NOOTA-DUAL ENVELOPE GENERATOR
POTSCALE1 = PAGE17.SchDoc: POTH (out), POTL (out)  | R__16_PartReference: R133; M26_PartReference: U34; M26_PACKAGE: POTSCALE2; R__2_PartReference: R129; M27_PartReference: U34; M27_PACKAGE: POTSCALE2; R__3_PartReference: R128; U__PartReference: U34; U__PACKAGE: POTSCALE2; R__5_PartReference: R130; R__17_PartReference: R131; R__19_PartReference: R132; R__12_PartReference: R134; C__2_PartReference: C62; C__3_PartReference: C63; TitleBlock_Page_Number: 22; TitleBlock_Title: NOOTA-POT SCALE VCO 1
POTSCALE2 = PAGE17.SchDoc: POTH (out), POTL (out)  | R__16_PartReference: R141; M26_PartReference: U35; M26_PACKAGE: POTSCALE1; R__2_PartReference: R137; M27_PartReference: U35; M27_PACKAGE: POTSCALE1; R__3_PartReference: R136; U__PartReference: U35; U__PACKAGE: POTSCALE1; R__5_PartReference: R138; R__17_PartReference: R139; R__19_PartReference: R140; R__12_PartReference: R142; C__2_PartReference: C64; C__3_PartReference: C65; TitleBlock_Page_Number: 23; TitleBlock_Title: NOOTA-POT SCALE VCO 2
REF = PAGE110.SchDoc: no entries  | M26_PartReference: U50; U__4_PartReference: U50; M27_PartReference: U51; U__5_PartReference: U51; U__PartReference: Q57; U__PACKAGE: POTSCALE; C__8_PartReference: C113; U__6_PartReference: U50; Q__PartReference: Q58; R__PartReference: R225; TitleBlock_Page_Number: 40; TitleBlock_Title: NOOTA-DUAL ENVELOPE GENERATOR
VCO1 = PAGE117.SchDoc: FC0 (in), FC1 (in), FC2 (in), FC3 (in), PWM0 (in), PWM1 (in), PWM2 (in), RAMP (out), PULSE (out)  | R__34_PartReference: R102; R__1_PartReference: R100; R__35_PartReference: R98; R__23_PartReference: R92; M__1_PartReference: M22; M__1_M26_PartReference: U40; M__1_D__PartReference: D9; M__1_D__1_PartReference: D10; M__1_M27_PartReference: U40; M__1_C__PartReference: C78; M__1_U__PartReference: U40; M__1_U__PACKAGE: POTSCALE; M__1_C__1_PartReference: C79; M__1_R__7_PartReference: R160; M__1_R__10_PartReference: R161; M__1_R__11_PartReference: R159; M__1_R__13_PartReference: R158; M__1_R__20_PartReference: R162; M__1_R__21_PartReference: R164; M__1_R__22_PartReference: R163; M__1_TitleBlock_Page_Number: 31; M__1_TitleBlock_Title: NOOTA-DUAL ENVELOPE GENERATOR; M__PartReference: M21; M__U__18_PartReference: U39; M__C__23_PartReference: C74; M__Q__12_PartReference: Q40; M__U__19_PartReference: U38; M__C__22_PartReference: C71; M__C__24_PartReference: C73; M__C__25_PartReference: C72; M__C__26_PartReference: C75; M__R__49_PartReference: R154; M__C__27_PartReference: C76; M__R__50_PartReference: R157; M__R__47_PartReference: R155; M__R__48_PartReference: R156; M__TitleBlock_6_Page_Number: 30; R__4_PartReference: R99; R__28_PartReference: R89; R__24_PartReference: R94; R__37_PartReference: R87; U__8_PartReference: U28; U__8_PACKAGE: VCO1_1; C__9_PartReference: R105; C__9_PCB_Footprint: AXIAL0.4; C__11_PartReference: C52; R__25_PartReference: R95; R__18_PartReference: R88; R__38_PartReference: R91; R__29_PartReference: R106; R__9_PartReference: R90; R__PartReference: M20; R__M26_PartReference: Q38; R__U__7_PartReference: U37; R__U__7_PACKAGE: BMEXPO; R__M27_PartReference: Q39; R__U__2_PartReference: U37; R__U__2_PACKAGE: BMEXPO; R__U__PartReference: Q34; R__U__PACKAGE: POTSCALE; R__C__4_PartReference: C67; R__U__3_PartReference: U37; R__U__3_PACKAGE: BMEXPO; R__Q__PartReference: Q33; R__C__6_PartReference: C69; R__C__7_PartReference: C70; R__Q__1_PartReference: Q35; R__C__5_PartReference: C68; R__Q__2_PartReference: Q36; R__Q__3_PartReference: Q37; R__R__14_PartReference: R153; R__R__15_PartReference: R152; R__TitleBlock_Page_Number: 29; R__TitleBlock_Title: NOOTA-DUAL ENVELOPE GENERATOR; R__26_PartReference: R97; C__12_PartReference: C53; R__30_PartReference: R107; R__27_PartReference: R103; R__31_PartReference: R104; U__10_PartReference: U28; U__10_PACKAGE: VCO1_1; R__36_PartReference: R101; U__11_PartReference: U28; U__11_PACKAGE: VCO1_1; JP__PartReference: JP18; TitleBlock_Page_Number: 15; TitleBlock_Title: NOOTA-DUAL ENVELOPE GENERATOR
VCO2 = PAGE117.SchDoc: FC0 (in), FC1 (in), FC2 (in), FC3 (in), PWM0 (in), PWM1 (in), PWM2 (in), RAMP (out), PULSE (out)  | R__34_PartReference: R180; R__1_PartReference: R178; R__35_PartReference: R176; R__23_PartReference: R170; M__1_PartReference: M25; M__1_M26_PartReference: U45; M__1_M26_PACKAGE: RAMP_PWM1; M__1_D__PartReference: D11; M__1_D__1_PartReference: D12; M__1_M27_PartReference: U45; M__1_M27_PACKAGE: RAMP_PWM1; M__1_C__PartReference: C93; M__1_U__PartReference: U45; M__1_U__PACKAGE: RAMP_PWM1; M__1_C__1_PartReference: C94; M__1_R__7_PartReference: R194; M__1_R__10_PartReference: R195; M__1_R__11_PartReference: R193; M__1_R__13_PartReference: R192; M__1_R__20_PartReference: R196; M__1_R__21_PartReference: R198; M__1_R__22_PartReference: R197; M__1_TitleBlock_Page_Number: 35; M__1_TitleBlock_Title: NOOTA-DUAL ENVELOPE GENERATOR; M__PartReference: M24; M__U__18_PartReference: U44; M__C__23_PartReference: C89; M__Q__12_PartReference: Q48; M__U__19_PartReference: U43; M__C__22_PartReference: C86; M__C__24_PartReference: C88; M__C__25_PartReference: C87; M__C__26_PartReference: C90; M__R__49_PartReference: R188; M__C__27_PartReference: C91; M__R__50_PartReference: R191; M__R__47_PartReference: R189; M__R__48_PartReference: R190; M__TitleBlock_6_Page_Number: 34; R__4_PartReference: R177; R__28_PartReference: R167; R__24_PartReference: R172; R__37_PartReference: R165; U__8_PartReference: U41; U__8_PACKAGE: VCO1_2; C__9_PartReference: R183; C__9_PCB_Footprint: AXIAL0.4; C__11_PartReference: C80; R__25_PartReference: R173; R__18_PartReference: R166; R__38_PartReference: R169; R__29_PartReference: R184; R__9_PartReference: R168; R__PartReference: M23; R__M26_PartReference: Q46; R__U__7_PartReference: U42; R__U__7_PACKAGE: BMEXPO1; R__M27_PartReference: Q47; R__U__2_PartReference: U42; R__U__2_PACKAGE: BMEXPO1; R__U__PartReference: Q42; R__U__PACKAGE: POTSCALE; R__C__4_PartReference: C82; R__U__3_PartReference: U42; R__U__3_PACKAGE: BMEXPO1; R__Q__PartReference: Q41; R__C__6_PartReference: C84; R__C__7_PartReference: C85; R__Q__1_PartReference: Q43; R__C__5_PartReference: C83; R__Q__2_PartReference: Q44; R__Q__3_PartReference: Q45; R__R__14_PartReference: R187; R__R__15_PartReference: R186; R__TitleBlock_Page_Number: 33; R__TitleBlock_Title: NOOTA-DUAL ENVELOPE GENERATOR; R__26_PartReference: R175; C__12_PartReference: C81; R__30_PartReference: R185; R__27_PartReference: R181; R__31_PartReference: R182; U__10_PartReference: U41; U__10_PACKAGE: VCO1_2; R__36_PartReference: R179; U__11_PartReference: U41; U__11_PACKAGE: VCO1_2; JP__PartReference: JP19; TitleBlock_Page_Number: 32; TitleBlock_Title: NOOTA-DUAL ENVELOPE GENERATOR

### Nets
+5VR: JP13.10 JP13.14
+10VR: JP6.2 JP9.2 JP9.6 JP9.10 JP9.14 JP10.2 JP10.6 JP10.10 JP10.14 JP11.2 JP13.2
+15: C2.1 C4.1 C6.1 C8.1 C10.1 C14.1 JP15.1 U1.8(V+) U2.8(V+) U3.8(V+) U4#2.8(V+) U5.8(V+) U7.8(V+)
-5VR: JP13.9 JP13.13 M15.-VR R240.2
-10VR: JP9.1 JP9.5 JP9.9 JP9.13 JP10.1 JP10.5 JP10.9 JP10.13
-15: C1.1 C3.1 C5.1 C7.1 C9.1 C13.1 JP15.4 U1.4(V-) U2.4(V-) U3.4(V-) U4#2.4(V-) U5.4(V-) U7.4(V-)
AGND: C1.2 C2.2 C3.2 C4.2 C5.2 C6.2 C7.2 C8.2 C9.2 C10.2 C13.2 C14.2 J1.3 J2.3 J3.3 J4.3 JP1.1 JP1.3 JP1.5 JP1.7 JP1.9 JP2.1 JP2.3 JP2.5 JP2.7 JP2.9 JP3.1 JP3.3 JP3.5 JP3.7 JP3.9 JP4.1 JP4.3 JP4.5 JP4.7 JP4.9 JP5.3 JP6.1 JP6.5 JP6.9 JP6.13 JP7.3 JP8.1 JP8.5 JP8.9 JP8.13 JP11.1 JP11.5 JP11.9 JP12.2 JP12.4 JP12.6 JP12.8 JP12.10 JP13.1 JP13.5 JP14.2 JP14.4 JP14.6 JP14.8 JP14.10 JP15.2 JP15.3 M15.CVN Q1.EMITTER Q4.EMITTER Q6.EMITTER R6.2 U7.3(+)  [also labelled GND, VEE, VSS]  [project net S2]
VCC: D1.ANODE D2.ANODE D3.ANODE Q2.EMITTER Q3.EMITTER Q5.EMITTER Q7.EMITTER Q8.EMITTER Q9.EMITTER
ADSR1: M2.IN M4.IN M7.IN M8.IN ; sheet EG1/EV_A
ADSR2: R7.1 ; sheet EG1/EV_B
ADSR_A0: sheet EG1/STATE_A0, sheet MIDI/ADSR_A0
ADSR_A1: sheet EG1/STATE_A1, sheet MIDI/ADSR_A1
ADSR_B0: sheet EG1/STATE_B0, sheet MIDI/ADSR_B0
ADSR_B1: sheet EG1/STATE_B1, sheet MIDI/ADSR_B1
BP: JP2.4 JP6.6 M14.BP
CMP_A: sheet EG1/CMP_A, sheet MIDI/ADSR-CMP_A
CMP_B: sheet EG1/CMP_B, sheet MIDI/ADSR-CMP_B  [project net B4]
FAH1: JP6.10 M8.POT_H
FAH2: JP6.14 M9.POT_H
FAW1: JP6.12 M8.POT_W
FAW2: JP6.16 M9.POT_W
FFP: JP6.4 M14.VC1
FQP: JP6.8 M14.Q
GRATE: JP13.4 M10.CVb
GRH: JP13.6 M1#1.POT_H
GRW: JP13.8 M1#1.POT_W
HP: JP2.6 M14.HP
LFO: M3.IN M5.IN M9.IN M12.TRI
LFO-F: M6.IN ; sheet MIDI/CV2
LP: JP2.2 M14.LP
MCLK: J2.1 R8.1 ; sheet MIDI/MIDICLK  [project net D6]
MRST: J4.1 R15.1 ; sheet MIDI/RESET  [project net B0]
MSS: J3.1 R12.1 ; sheet MIDI/START-STOP  [project net D7]
PW1: JP13.12 ; sheet VCO1/PWM0
PW2: JP13.16 ; sheet VCO2/PWM0
VATN_H0: JP8.2 M2.POT_H
VATN_H1: JP8.6 M3.POT_H
VATN_H2: JP8.10 M4.POT_H
VATN_H3: JP8.14 M5.POT_H
VATN_W0: JP8.4 M2.POT_W
VATN_W1: JP8.8 M3.POT_W
VATN_W2: JP8.12 M4.POT_W
VATN_W3: JP8.16 M5.POT_W
VP1: JP5.2 ; sheet VCO1/FC1
VP2: JP7.2 ; sheet VCO2/FC1
Net=M__1_PartReference_VCO1_PWMOUT: JP4.4 ; sheet VCO1/PULSE
Net=M__1_PartReference_VCO1_RAMPOUT: JP4.2 ; sheet VCO1/RAMP
Net=M__1_PartReference_VCO2_PWMOUT: JP4.8 ; sheet VCO2/PULSE
Net=M__1_PartReference_VCO2_RAMPOUT: JP4.6 ; sheet VCO2/RAMP
Net=R__5_PartReference_POTSCALE1_2: JP5.1 ; sheet POTSCALE1/POTH
Net=R__5_PartReference_POTSCALE2_2: JP7.1 ; sheet POTSCALE2/POTH
Net=R__16_PartReference_POTSCALE1_2: JP5.4 ; sheet POTSCALE1/POTL
Net=R__16_PartReference_POTSCALE2_2: JP7.4 ; sheet POTSCALE2/POTL
Net=R__24_PartReference_VCO1_1: M10.OUT ; sheet VCO1/FC0, sheet VCO2/FC0
Net=R__26_PartReference_VCO1_1: M2.OUT ; sheet VCO1/FC2, sheet VCO2/FC2
Net=R__27_PartReference_VCO1_1: M3.OUT ; sheet VCO1/FC3, sheet VCO2/FC3
Net=R__29_PartReference_VCO1_1: M4.OUT ; sheet VCO1/PWM1, sheet VCO2/PWM1
Net=R__30_PartReference_VCO1_1: M5.OUT ; sheet VCO1/PWM2, sheet VCO2/PWM2
NetD1_CATHODE: D1.CATHODE R5.2
NetD2_CATHODE: D2.CATHODE R10.2
NetD3_CATHODE: D3.CATHODE R13.2
NetJ1_1: J1.1 R1.2 U7.1(OUT)
NetJP1_2: JP1.2 M13.I1
NetJP1_4: JP1.4 M13.I2
NetJP1_6: JP1.6 M13.I3
NetJP1_8: JP1.8 M13.I4
NetJP1_10: JP1.10 M13.I5
NetJP3_2: JP3.2 R2.1
NetJP3_4: JP3.4 R3.1
NetJP3_6: JP3.6 R4.1
NetJP4_10: JP4.10 M11.NOISE
NetJP9_4: JP9.4 ; sheet EG1/ATTACK0
NetJP9_8: JP9.8 ; sheet EG1/DECAY0
NetJP9_12: JP9.12 ; sheet EG1/SUS0
NetJP9_16: JP9.16 ; sheet EG1/RELEASE0
NetJP10_4: JP10.4 ; sheet EG1/ATTACK1
NetJP10_8: JP10.8 ; sheet EG1/DECAY1
NetJP10_12: JP10.12 ; sheet EG1/SUS1
NetJP10_16: JP10.16 ; sheet EG1/RELEASE1
NetJP11_4: JP11.4 M12.FC3
NetJP11_6: JP11.6 M6.POT_H
NetJP11_8: JP11.8 M6.POT_W
NetJP11_10: JP11.10 M7.POT_H
NetJP11_12: JP11.12 M7.POT_W
NetJP12_1: JP12.1 Q2.COLLECTOR
NetJP12_5: JP12.5 Q3.COLLECTOR
NetJP12_7: JP12.7 Q5.COLLECTOR
NetJP14_1: JP14.1 Q7.COLLECTOR
NetJP14_5: JP14.5 Q8.COLLECTOR
NetJP14_7: JP14.7 Q9.COLLECTOR
NetM1#1_IN: M1#1.IN ; sheet MIDI/CV1
NetM1#1_OUT: M1#1.OUT M10.CVa
NetM6_OUT: M6.OUT M12.FC2
NetM7_OUT: M7.OUT M12.FC1
NetM8_OUT: M8.OUT M14.VC2
NetM9_OUT: M9.OUT M14.VC3
NetM10_IN: M10.IN ; sheet MIDI/CV0
NetM13_OUT: M13.OUT M14.IN
NetM15_CVP: M15.CVP R6.1 R7.2 R240.1
NetM15_Iin: M15.Iin R2.2 R3.2 R4.2
NetM15_Io: M15.Io R1.1 U7.2(-)
NetQ1_BASE: Q1.BASE R8.2
NetQ1_COLLECTOR: Q1.COLLECTOR R5.1
NetQ2_BASE: Q2.BASE R9.2
NetQ3_BASE: Q3.BASE R11.2
NetQ4_BASE: Q4.BASE R12.2
NetQ4_COLLECTOR: Q4.COLLECTOR R10.1
NetQ5_BASE: Q5.BASE R14.2
NetQ6_BASE: Q6.BASE R15.2
NetQ6_COLLECTOR: Q6.COLLECTOR R13.1
NetQ7_BASE: Q7.BASE R16.2
NetQ8_BASE: Q8.BASE R17.2
NetQ9_BASE: Q9.BASE R18.2
NetR9_1: R9.1 ; sheet EG1/A0
NetR11_1: R11.1 ; sheet EG1/S0
NetR14_1: R14.1 ; sheet EG1/R0
NetR16_1: R16.1 ; sheet EG1/A1
NetR17_1: R17.1 ; sheet EG1/S1
NetR18_1: R18.1 ; sheet EG1/R1

Not connected (* = marked no-connect by the designer): J1 2; J2 2; J3 2; J4 2; JP2 8 10; JP3 8 10; JP6 3 7 11 15; JP8 3 7 11 15; JP9 3 7 11 15; JP10 3 7 11 15; JP11 3 7 11 13 14 15 16; JP12 3 9; JP13 3 7 11 15; JP14 3 9; M12 SQR

### Notes on the sheet
- (near JP6) 500-1071
- 500-1071
- (near J1) AUDIO OUT
- MIDI CLOCK
- (near JP10) 500-1071
- MIDI START STOP
- (near JP12) 500-1071
- (near J4) MIDI RESET
- (near JP11) 500-1071
- (near JP13) 500-1071
- (near JP14) 500-1071
- (near JP15) POWER
- (in symbol ATNEXPOT) H; W
- (in symbol BM VCA) Vr
- (in symbol NOISE) N

### Library data of the parts
C1-C10 C13 C14 = CAP_Dup1
JP5 JP7 = HEADER 4_Dup1
M1#1 = ATNEXPOT: R__6_PartReference: R108; R__8_PartReference: R109; U__1_PartReference: U1; U__1_PACKAGE: ATNM1MIX; TitleBlock_1_Title: NOOTA - CV ATN -1; TitleBlock_1_Page_Number: 16
M2 = ATNEXPOT: R__6_PartReference: R114; R__8_PartReference: R115; U__1_PartReference: U5; U__1_PACKAGE: ATNM2M3; TitleBlock_1_Title: NOOTA - CV ATN-2; TitleBlock_1_Page_Number: 19
M3 = ATNEXPOT: R__6_PartReference: R110; R__8_PartReference: R111; U__1_PartReference: U5; U__1_PACKAGE: ATNM2M3; TitleBlock_1_Title: NOOTA - CV ATN -3; TitleBlock_1_Page_Number: 17
M4 = ATNEXPOT: R__6_PartReference: R112; R__8_PartReference: R113; U__1_PartReference: U3; U__1_PACKAGE: ATNM4M5; TitleBlock_1_Title: NOOTA - CV ATN-4; TitleBlock_1_Page_Number: 18
M5 = ATNEXPOT: R__6_PartReference: R126; R__8_PartReference: R127; U__1_PartReference: U3; U__1_PACKAGE: ATNM4M5; TitleBlock_1_Title: NOOTA - CV ATN-5; TitleBlock_1_Page_Number: 21
M6 = ATNEXPOT: R__6_PartReference: R148; R__8_PartReference: R149; U__1_PartReference: U4; U__1_PACKAGE: ATNM6M7; TitleBlock_1_Title: NOOTA - CV ATN-6; TitleBlock_1_Page_Number: 26
M7 = ATNEXPOT: R__6_PartReference: R150; R__8_PartReference: R151; U__1_PartReference: U4; U__1_PACKAGE: ATNM6M7; TitleBlock_1_Title: NOOTA - CV ATN-7; TitleBlock_1_Page_Number: 27
M8 = ATNEXPOT: R__6_PartReference: R146; R__8_PartReference: R147; U__1_PartReference: U2; U__1_PACKAGE: ATNM8M9; TitleBlock_1_Title: NOOTA - CV ATN-8; TitleBlock_1_Page_Number: 25
M9 = ATNEXPOT: R__6_PartReference: R144; R__8_PartReference: R145; U__1_PartReference: U2; U__1_PACKAGE: ATNM8M9; TitleBlock_1_Title: NOOTA - CV ATN-9; TitleBlock_1_Page_Number: 24
M10 = GLIDE: TitleBlock_4_Page_Number: 7
M11 = NOISE: C__8_PartReference: R58; C__9_PartReference: C29; C__9_PCB_Footprint: RB5/2; TitleBlock_2_Page_Number: 6; TitleBlock_2_Title: NOOTA- CHEEZY MIXER
M12 = LFO-BM: M1_1_TitleBlock_2_Page_Number: 5; M1_1_TitleBlock_2_Title: NOOTA- CHEEZY MIXER
M13 = MIX: TitleBlock_2_Page_Number: 9; TitleBlock_2_Title: NOOTA- CHEEZY MIXER
M14 = BM-VCF: C__13_PartReference: C98; M16_U__9_PartReference: U47; M16_Q__7_PartReference: Q49; M16_Q__4_PartReference: Q51; M16_Q__5_PartReference: Q50; M16_Q__6_PartReference: Q52; M16_R__32_PartReference: R211; M16_R__33_PartReference: R212; M16_C__10_PartReference: C103; C__14_PartReference: C100; M17_U__9_PartReference: U48; M17_Q__7_PartReference: Q53; M17_Q__4_PartReference: Q55; M17_Q__5_PartReference: Q54; M17_Q__6_PartReference: Q56; M17_R__32_PartReference: R213; M17_R__33_PartReference: R214; M17_C__10_PartReference: C104; M16_U__9_PACKAGE: VCF1; M16_TitleBlock_2_Page_Number: 37; M16_TitleBlock_2_Title: NOOTA-BLACKMER VCA-VCF M16; M17_U__9_PACKAGE: VCF2; M17_TitleBlock_2_Page_Number: 38; M17_TitleBlock_2_Title: NOOTA-BLACKMER VCA-VCF M17; TitleBlock_1_Page_Number: 36; TitleBlock_1_Title: MIDI CONNECTORS
M15 = BM VCA: U__9_PartReference: U7; Q__7_PartReference: Q29; Q__4_PartReference: Q31; Q__5_PartReference: Q30; Q__6_PartReference: Q32; R__32_PartReference: R71; R__33_PartReference: R72; C__10_PartReference: C37; TitleBlock_2_Page_Number: 8; TitleBlock_2_Title: NOOTA-BLACKMER VCA M15; U__9_PACKAGE: VCA
Q1 Q4 Q6 = NPN
Q2 Q3 Q5 Q7-Q9 = PNP
R1-R18 R240 = R_Dup1
U1-U3 U4#2 U5 U7 = GEN DUAL OPAMP-H
  U1: PACKAGE: ATNM1MIX
  U2: PACKAGE: ATNM8M9
  U3: PACKAGE: ATNM4M5
  U4#2: PACKAGE: ATNM6M7
  U5: PACKAGE: ATNM2M3
  U7: PACKAGE: VCA

## Sheet PAGE17.SchDoc
size 246 x 182 mm
Used 2 times, as channels POTSCALE1, POTSCALE2. Parts and nets are listed once, with the designators drawn on the sheet.
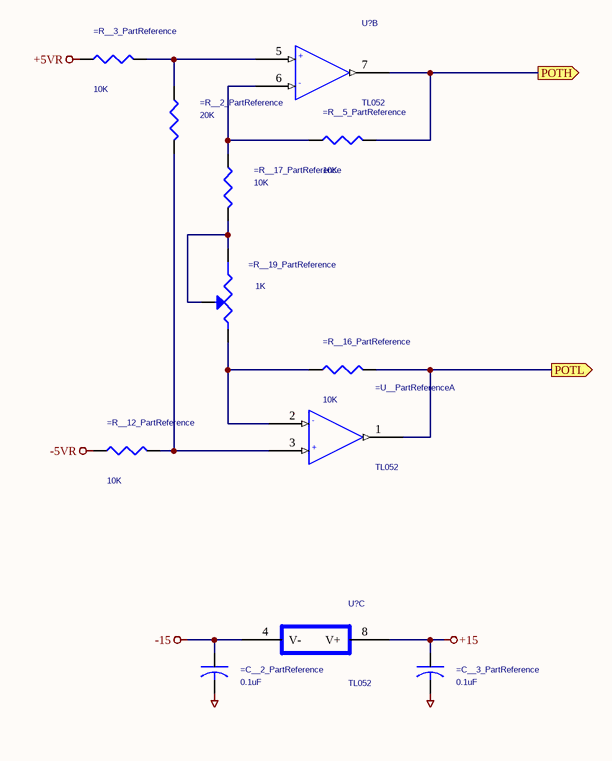
[diagram p11: PAGE17.SchDoc]

### Parts
(Parts that share a designator on the sheet are numbered #1, #2 ... from top to bottom, then left to right.)
=C__2_PartReference  0.1uF  [AXIALCAP0.3]
=C__3_PartReference  0.1uF  [AXIALCAP0.3]
=R__2_PartReference  20K  [AXIAL0.4]
=R__3_PartReference  10K  [AXIAL0.4]
=R__5_PartReference  10K  [AXIAL0.4]
=R__12_PartReference  10K  [AXIAL0.4]
=R__16_PartReference  10K  [AXIAL0.4]
=R__17_PartReference  10K  [AXIAL0.4]
=R__19_PartReference  1K  [TRIMPOT-3006]
=U__PartReference  TL052  [DIP8]  (part A of 3)
U?#1  TL052  [DIP8]  (part B of 3)
U?#2  TL052  [DIP8]  (part C of 3)

### Ports
POTH (out), POTL (out)

### Nets
+5VR: =R__3_PartReference.1
+15: =C__3_PartReference.1 U?#2.8(V+)
-5VR: =R__12_PartReference.1
-15: =C__2_PartReference.1 U?#2.4(V-)
AGND: =C__2_PartReference.2 =C__3_PartReference.2
POTH: =R__5_PartReference.2 U?#1.7(OUT) ; port POTH
POTL: =R__16_PartReference.2 =U__PartReference.1(OUT) ; port POTL
Net=R__2_PartReference_1: =R__2_PartReference.1 =R__3_PartReference.2 U?#1.5(+)
Net=R__2_PartReference_2: =R__2_PartReference.2 =R__12_PartReference.2 =U__PartReference.3(+)
Net=R__5_PartReference_1: =R__5_PartReference.1 =R__17_PartReference.1 U?#1.6(-)
Net=R__16_PartReference_1: =R__16_PartReference.1 =R__19_PartReference.A =U__PartReference.2(-)
Net=R__17_PartReference_2: =R__17_PartReference.2 =R__19_PartReference.B =R__19_PartReference.WIPER

### Channels
POTSCALE1: designators =C__2_PartReference==C__2_PartReference_POTSCALE1 =C__3_PartReference==C__3_PartReference_POTSCALE1 =R__2_PartReference==R__2_PartReference_POTSCALE1 =R__3_PartReference==R__3_PartReference_POTSCALE1 =R__5_PartReference==R__5_PartReference_POTSCALE1 =R__12_PartReference==R__12_PartReference_POTSCALE1 =R__16_PartReference==R__16_PartReference_POTSCALE1 =R__17_PartReference==R__17_PartReference_POTSCALE1 =R__19_PartReference==R__19_PartReference_POTSCALE1 =U__PartReference==U__PartReference_POTSCALE1 U?=U?_POTSCALE1#1 U?=U?_POTSCALE1#2; ports POTH=Net=R__5_PartReference_POTSCALE1_2 POTL=Net=R__16_PartReference_POTSCALE1_2
POTSCALE2: designators =C__2_PartReference==C__2_PartReference_POTSCALE2 =C__3_PartReference==C__3_PartReference_POTSCALE2 =R__2_PartReference==R__2_PartReference_POTSCALE2 =R__3_PartReference==R__3_PartReference_POTSCALE2 =R__5_PartReference==R__5_PartReference_POTSCALE2 =R__12_PartReference==R__12_PartReference_POTSCALE2 =R__16_PartReference==R__16_PartReference_POTSCALE2 =R__17_PartReference==R__17_PartReference_POTSCALE2 =R__19_PartReference==R__19_PartReference_POTSCALE2 =U__PartReference==U__PartReference_POTSCALE2 U?=U?_POTSCALE2#1 U?=U?_POTSCALE2#2; ports POTH=Net=R__5_PartReference_POTSCALE2_2 POTL=Net=R__16_PartReference_POTSCALE2_2

### Library data of the parts
=C__2_PartReference =C__3_PartReference = CAP_Dup1
=R__2_PartReference =R__3_PartReference =R__5_PartReference =R__12_PartReference =R__16_PartReference =R__17_PartReference = R_Dup1
=R__19_PartReference = POT
=U__PartReference U?#1 U?#2 = GEN DUAL OPAMP-H
  =U__PartReference: PACKAGE: =U__PACKAGE
  U?#1 U?#2: PACKAGE: POTSCALE

## Sheet PAGE13.SchDoc
size 246 x 208 mm
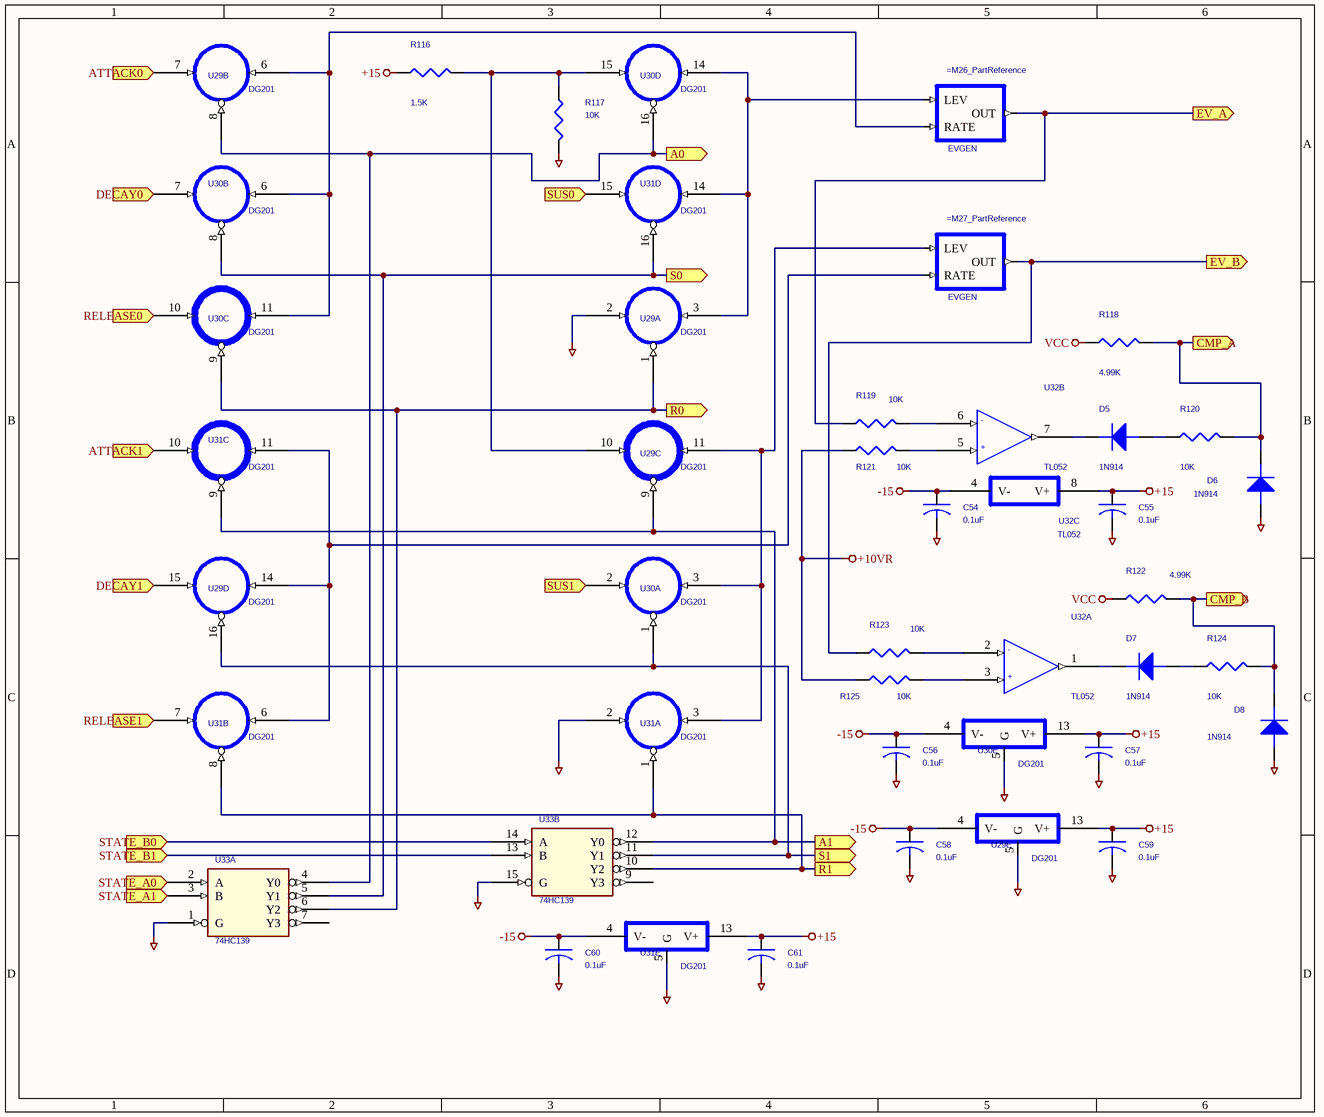
[diagram p12: PAGE13.SchDoc]

### Parts
=M26_PartReference  EVGEN
=M27_PartReference  EVGEN
C54  0.1uF  [AXIALCAP0.3]
C55  0.1uF  [AXIALCAP0.3]
C56  0.1uF  [AXIALCAP0.3]
C57  0.1uF  [AXIALCAP0.3]
C58  0.1uF  [AXIALCAP0.3]
C59  0.1uF  [AXIALCAP0.3]
C60  0.1uF  [AXIALCAP0.3]
C61  0.1uF  [AXIALCAP0.3]
D5  1N914  [DIODE0.4]
D6  1N914  [DIODE0.4]
D7  1N914  [DIODE0.4]
D8  1N914  [DIODE0.4]
R116  1.5K  [AXIAL0.4]
R117  10K  [AXIAL0.4]
R118  4.99K  [AXIAL0.4]
R119  10K  [AXIAL0.4]
R120  10K  [AXIAL0.4]
R121  10K  [AXIAL0.4]
R122  4.99K  [AXIAL0.4]
R123  10K  [AXIAL0.4]
R124  10K  [AXIAL0.4]
R125  10K  [AXIAL0.4]
U29  DG201  [DIP16]  (parts A,B,C,D,E of 5)
U30  DG201  [DIP16]  (parts A,B,C,D,E of 5)
U31  DG201  [DIP16]  (parts A,B,C,D,E of 5)
U32  TL052  [DIP8]  (parts A,B,C of 3)
U33  74HC139  [DIP16]  (parts A,B of 2)

### Ports
A0 (out), A1 (out), ATTACK0 (in), ATTACK1 (in), CMP_A (out), CMP_B (out), DECAY0 (in), DECAY1 (in), EV_A (out), EV_B (out), R0 (out), R1 (out), RELEASE0 (in), RELEASE1 (in), S0 (out), S1 (out), STATE_A0 (in), STATE_A1 (in), STATE_B0 (in), STATE_B1 (in), SUS0 (in), SUS1 (in)

### Nets
+10VR: R121.1 R125.1
+15: C55.1 C57.1 C59.1 C61.1 R116.1 U29.13(V+) U30.13(V+) U31.13(V+) U32.8(V+)
-15: C54.1 C56.1 C58.1 C60.1 U29.4(V-) U30.4(V-) U31.4(V-) U32.4(V-)
AGND: C54.2 C55.2 C56.2 C57.2 C58.2 C59.2 C60.2 C61.2 D6.ANODE D8.ANODE R117.2 U29.2(D) U29.5(G) U30.5(G) U31.2(D) U31.5(G) U33.1(G) U33.8(GND) U33.15(G)  [also labelled GND]  [project net S2]
VCC: R118.1 R122.1 U33.16(VCC)
ADSR1: =M26_PartReference.OUT R119.1 ; port EV_A
ADSR2: =M27_PartReference.OUT R123.1 ; port EV_B
ADSR_A0: U33.2(A) ; port STATE_A0
ADSR_A1: U33.3(B) ; port STATE_A1
ADSR_B0: U33.14(A) ; port STATE_B0
ADSR_B1: U33.13(B) ; port STATE_B1
B4: D8.CATHODE R122.2 R124.2 ; port CMP_B
CMP_A: D6.CATHODE R118.2 R120.2 ; port CMP_A
Net=M26_PartReference_LEV: =M26_PartReference.LEV U29.3(S1) U30.14(S1) U31.14(S1)
Net=M26_PartReference_RATE: =M26_PartReference.RATE U29.6(S1) U30.6(S1) U30.11(S1)
Net=M27_PartReference_LEV: =M27_PartReference.LEV U29.11(S1) U30.3(S1) U31.3(S1)
Net=M27_PartReference_RATE: =M27_PartReference.RATE U29.14(S1) U31.6(S1) U31.11(S1)
NetD5_ANODE: D5.ANODE R120.1
NetD5_CATHODE: D5.CATHODE U32.7(OUT)
NetD7_ANODE: D7.ANODE R124.1
NetD7_CATHODE: D7.CATHODE U32.1(OUT)
NetJP9_4: U29.7(D) ; port ATTACK0
NetJP9_8: U30.7(D) ; port DECAY0
NetJP9_12: U31.15(D) ; port SUS0
NetJP9_16: U30.10(D) ; port RELEASE0
NetJP10_4: U31.10(D) ; port ATTACK1
NetJP10_8: U29.15(D) ; port DECAY1
NetJP10_12: U30.2(D) ; port SUS1
NetJP10_16: U31.7(D) ; port RELEASE1
NetR9_1: U29.8(IN) U30.16(IN) U33.4(Y0) ; port A0
NetR11_1: U30.8(IN) U31.16(IN) U33.5(Y1) ; port S0
NetR14_1: U29.1(IN) U30.9(IN) U33.6(Y2) ; port R0
NetR16_1: U29.9(IN) U31.9(IN) U33.12(Y0) ; port A1
NetR17_1: U29.16(IN) U30.1(IN) U33.11(Y1) ; port S1
NetR18_1: U31.1(IN) U31.8(IN) U33.10(Y2) ; port R1
NetR116_2: R116.2 R117.1 U29.10(D) U30.15(D)
NetR119_2: R119.2 U32.6(-)
NetR121_2: R121.2 U32.5(+)
NetR123_2: R123.2 U32.2(-)
NetR125_2: R125.2 U32.3(+)

Not connected (* = marked no-connect by the designer): U33 7(Y3) 9(Y3)

### Library data of the parts
C54-C61 = CAP_Dup1
D5-D8 = DIODE
R116-R125 = R_Dup1
U29-U31 = DG201H_Dup1: DIGIKEY PN: ADG201AKNZ-ND
  U29: PACKAGE: EG1
  U30: PACKAGE: EG3
  U31: PACKAGE: EG2
U32 = GEN DUAL OPAMP-H: PACKAGE: EG4
=M26_PartReference =M27_PartReference = EVGEN
  =M26_PartReference: PACKAGE: =M26_PACKAGE; TitleBlock_1_Page_Number: =M26_TitleBlock_1_Page_Number; TitleBlock_1_Title: =M26_TitleBlock_1_Title; Q__11_PartReference: =M26_Q__11_PartReference; Q__8_PartReference: =M26_Q__8_PartReference; C__17_PartReference: =M26_C__17_PartReference; U__17_PartReference: =M26_U__17_PartReference; U__17_PACKAGE: =M26_U__17_PACKAGE; Q__9_PartReference: =M26_Q__9_PartReference; C__18_PartReference: =M26_C__18_PartReference; R__43_PartReference: =M26_R__43_PartReference; C__19_PartReference: =M26_C__19_PartReference; U__12_PartReference: =M26_U__12_PartReference; U__12_PACKAGE: =M26_U__12_PACKAGE; R__44_PartReference: =M26_R__44_PartReference; C__20_PartReference: =M26_C__20_PartReference; R__45_PartReference: =M26_R__45_PartReference; Q__10_PartReference: =M26_Q__10_PartReference; C__15_PartReference: =M26_C__15_PartReference; U__13_PartReference: =M26_U__13_PartReference; U__13_PACKAGE: =M26_U__13_PACKAGE; R__39_PartReference: =M26_R__39_PartReference; U__14_PartReference: =M26_U__14_PartReference; U__14_PACKAGE: =M26_U__14_PACKAGE; C__16_PartReference: =M26_C__16_PartReference; U__15_PartReference: =M26_U__15_PartReference; U__15_PACKAGE: =M26_U__15_PACKAGE; R__40_PartReference: =M26_R__40_PartReference; U__16_PartReference: =M26_U__16_PartReference; U__16_PACKAGE: =M26_U__16_PACKAGE; R__41_PartReference: =M26_R__41_PartReference; R__46_PartReference: =M26_R__46_PartReference; R__42_PartReference: =M26_R__42_PartReference; TitleBlock_7_Page_Number: =M26_TitleBlock_7_Page_Number; TitleBlock_7_Title: =M26_TitleBlock_7_Title
  =M27_PartReference: PACKAGE: =M27_PACKAGE; C__21_PartReference: =M27_C__21_PartReference; TitleBlock_1_Page_Number: =M27_TitleBlock_1_Page_Number; TitleBlock_1_Title: =M27_TitleBlock_1_Title; Q__11_PartReference: =M27_Q__11_PartReference; Q__8_PartReference: =M27_Q__8_PartReference; C__17_PartReference: =M27_C__17_PartReference; U__17_PartReference: =M27_U__17_PartReference; U__17_PACKAGE: =M27_U__17_PACKAGE; Q__9_PartReference: =M27_Q__9_PartReference; C__18_PartReference: =M27_C__18_PartReference; R__43_PartReference: =M27_R__43_PartReference; C__19_PartReference: =M27_C__19_PartReference; U__12_PartReference: =M27_U__12_PartReference; U__12_PACKAGE: =M27_U__12_PACKAGE; R__44_PartReference: =M27_R__44_PartReference; C__20_PartReference: =M27_C__20_PartReference; R__45_PartReference: =M27_R__45_PartReference; Q__10_PartReference: =M27_Q__10_PartReference; C__15_PartReference: =M27_C__15_PartReference; U__13_PartReference: =M27_U__13_PartReference; U__13_PACKAGE: =M27_U__13_PACKAGE; R__39_PartReference: =M27_R__39_PartReference; U__14_PartReference: =M27_U__14_PartReference; U__14_PACKAGE: =M27_U__14_PACKAGE; C__16_PartReference: =M27_C__16_PartReference; U__15_PartReference: =M27_U__15_PartReference; U__15_PACKAGE: =M27_U__15_PACKAGE; R__40_PartReference: =M27_R__40_PartReference; U__16_PartReference: =M27_U__16_PartReference; U__16_PACKAGE: =M27_U__16_PACKAGE; R__41_PartReference: =M27_R__41_PartReference; R__46_PartReference: =M27_R__46_PartReference; R__42_PartReference: =M27_R__42_PartReference; TitleBlock_7_Page_Number: =M27_TitleBlock_7_Page_Number; TitleBlock_7_Title: =M27_TitleBlock_7_Title